# Altium project acopians-powerspy-monitoring-hw.PrjPcb
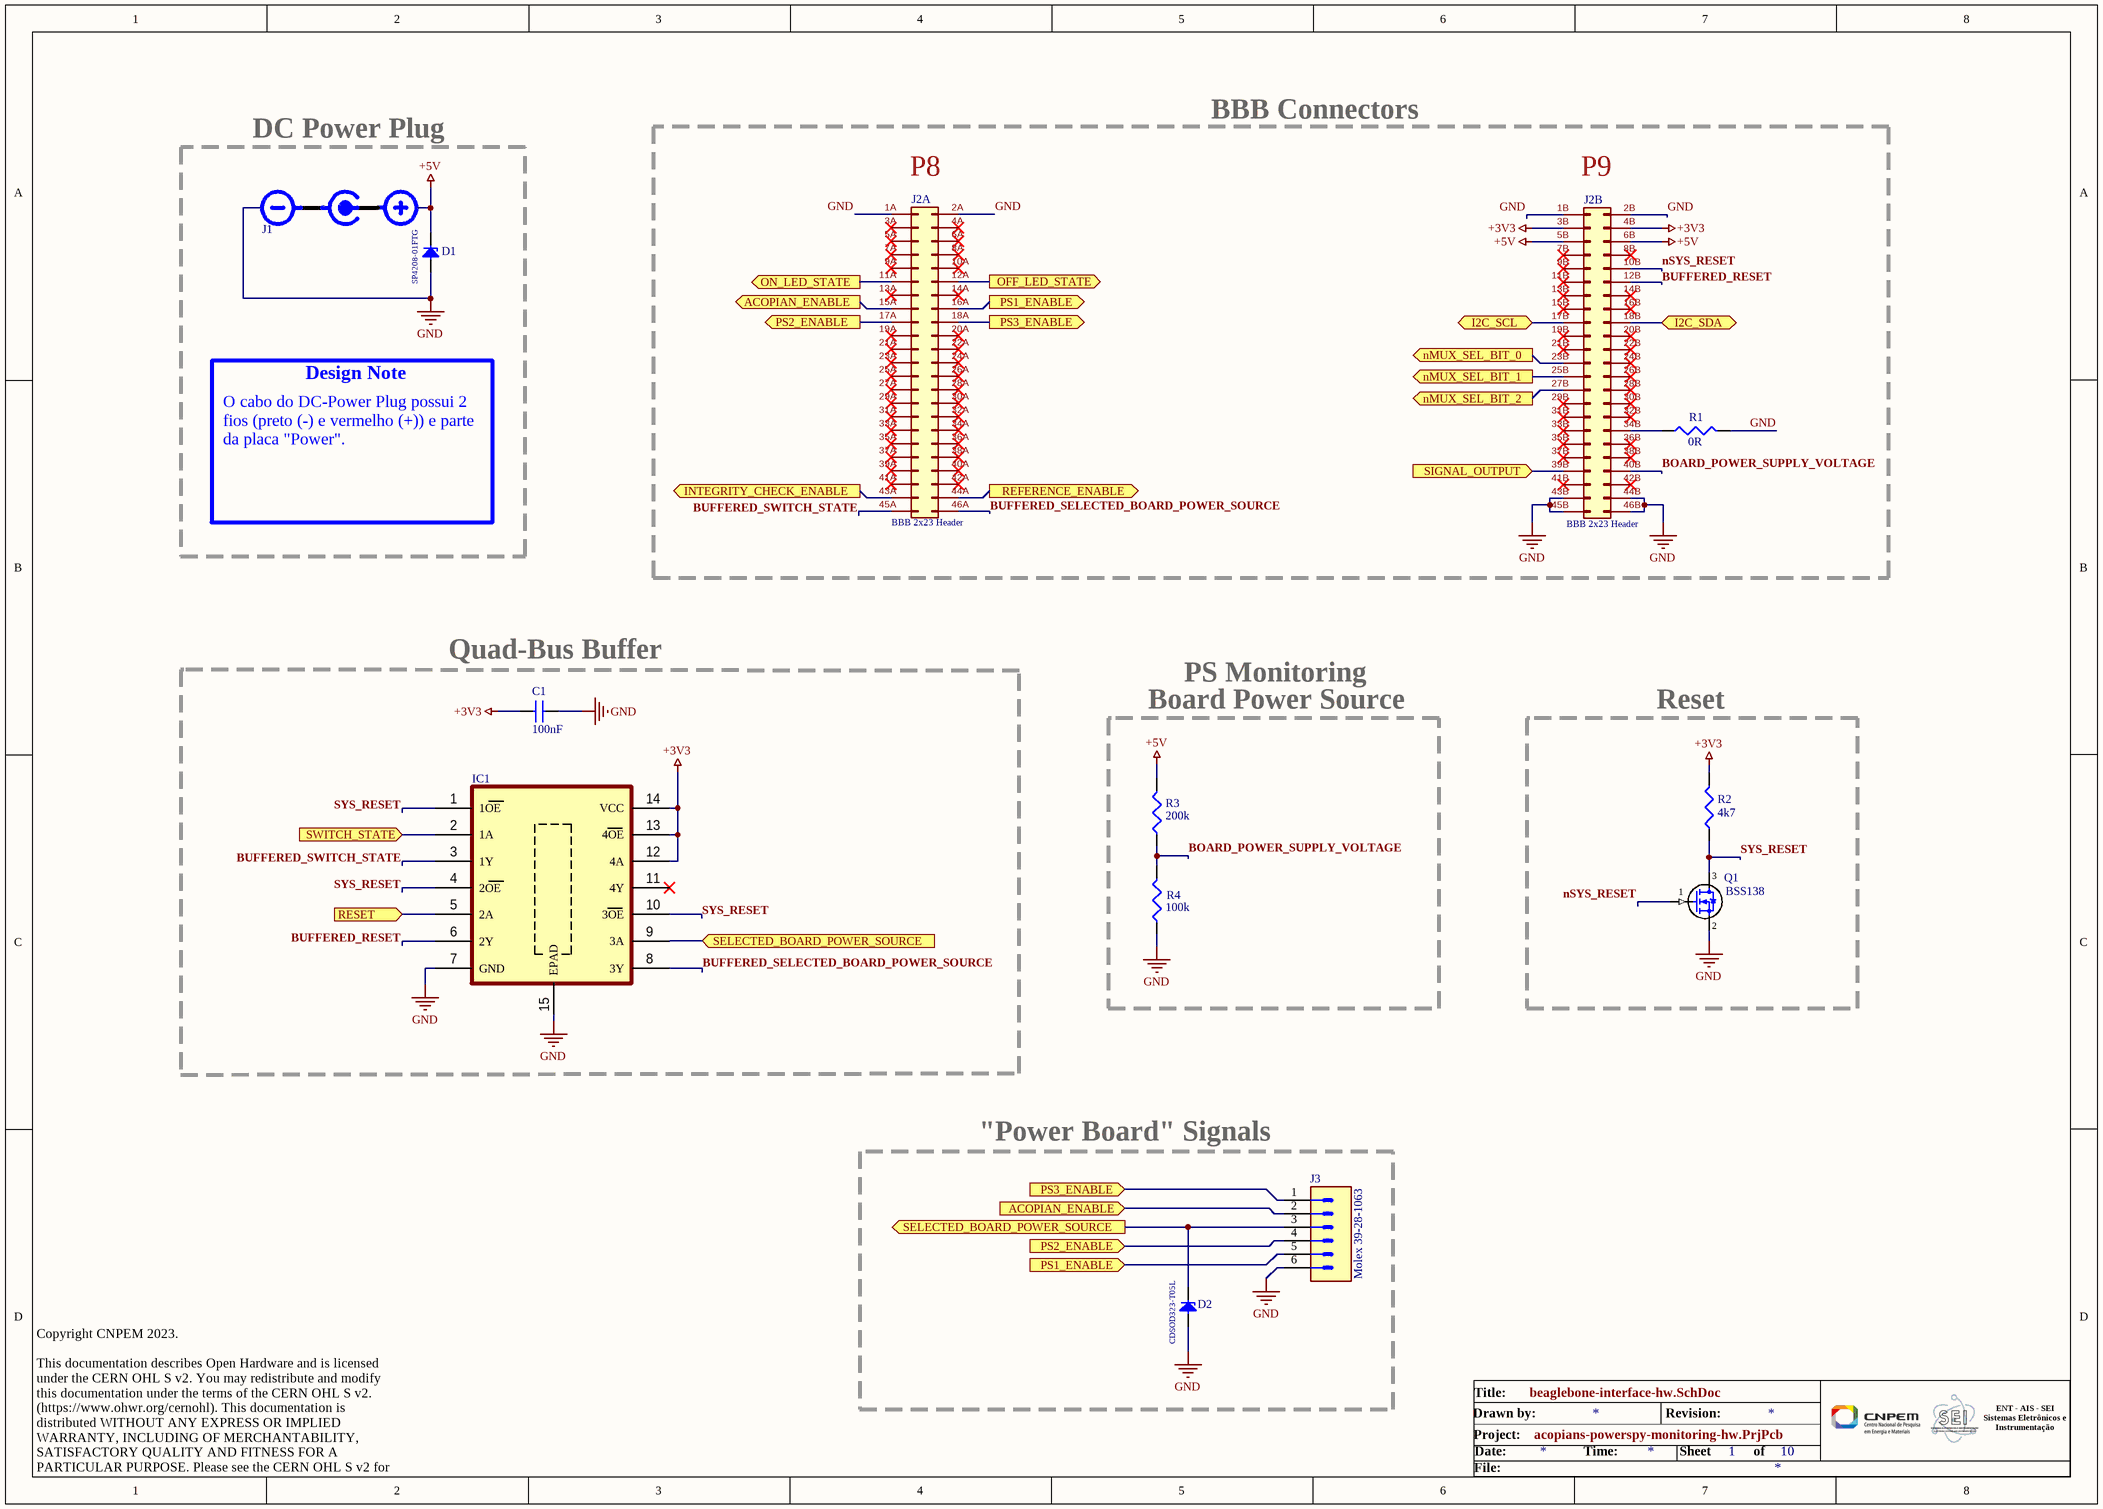
[diagram p0: beaglebone-interface-hw.SchDoc]
Project Link: =ProjectLink
10 sheets, 249 parts. Net scope: flat (ports and power ports of the same name join across sheets).
Board file: pcb-acopians-powerspy-monitoring-hw.PcbDoc
Sheets:
  beaglebone-interface-hw.SchDoc
  calibration-hw.SchDoc
  frontpanel-hw.SchDoc
  isolated-analog-interface-hw.SchDoc
  measurement-output-hw.SchDoc
  measurement-ps1-hw.SchDoc
  measurement-ps2-hw.SchDoc
  measurement-ps3-hw.SchDoc
  power-supplies-hw.SchDoc
  temp-sensor-interface-hw.SchDoc

## Sheet beaglebone-interface-hw.SchDoc
size A3; SheetNumber: 1; SheetTotal: 10

### Parts
C1  100nF  [C0805]
D1  SP4208-01FTG  [SOD-323]
D2  CDSOD323-T05L  [SOD-323]
IC1  SN74LV125ARGYR  [VQFN-14]  (value not drawn)
J1  DC Power Plug  (value not drawn)  (graphical)
J2  BBB 2x23 Header  [BBB 2x23 Header]  (parts A,B of 2)
J3  Molex 39-28-1063  [MOLEX_39-28-1063]
Q1  BSS138  [SOT_23_3]
R1  0R  [R1210]
R2  4k7  [Resistor 0805]
R3  200k  [Resistor 0805]
R4  100k  [Resistor 0805]

### Blocks framed on the sheet
DC Power Plug: D1 J1
Quad-Bus Buffer: C1 IC1
Board Power Source: R3 R4
Reset: Q1 R2
"Power Board" Signals: D2 J3

### Ports
ACOPIAN_ENABLE (in, see beaglebone-interface-hw[3A]), ACOPIAN_ENABLE (out, see beaglebone-interface-hw[4D]), I2C_SCL (bidir, see temp-sensor-interface-hw[5B]), I2C_SDA (bidir, see temp-sensor-interface-hw[5B]), INTEGRITY_CHECK_ENABLE (out, see calibration-hw[6B]), nMUX_SEL_BIT_0 (out, see isolated-analog-interface-hw[5B]), nMUX_SEL_BIT_1 (out, see isolated-analog-interface-hw[5C]), nMUX_SEL_BIT_2 (out, see isolated-analog-interface-hw[5C]), OFF_LED_STATE (out, see frontpanel-hw[5D]), ON_LED_STATE (out, see frontpanel-hw[5C]), PS1_ENABLE (in, see beaglebone-interface-hw[4A]), PS1_ENABLE (out, see beaglebone-interface-hw[4D]), PS2_ENABLE (in, see beaglebone-interface-hw[3A]), PS2_ENABLE (out, see beaglebone-interface-hw[4D]), PS3_ENABLE (in, see beaglebone-interface-hw[4A]), PS3_ENABLE (out, see beaglebone-interface-hw[4D]), REFERENCE_ENABLE (out, see calibration-hw[6C]), RESET (in, see frontpanel-hw[5B]), SELECTED_BOARD_POWER_SOURCE (in, see beaglebone-interface-hw[4D]), SELECTED_BOARD_POWER_SOURCE (out, see beaglebone-interface-hw[3C]), SIGNAL_OUTPUT (in, see isolated-analog-interface-hw[10C]), SWITCH_STATE (in, see frontpanel-hw[5A])

### Nets
+3V3: C1.2 IC1.12(4A) IC1.13(4OE) IC1.14(VCC) J2.3B(Pin_3) J2.4B(Pin_4) R2.2
+5V: D1.1 J1.2(+VCC) J2.5B(Pin_5) J2.6B(Pin_6) R3.2
GND: C1.1 D1.2 D2.2 IC1.7(GND) IC1.15(EPAD) J1.1(GND) J2.1A(Pin_1) J2.1B(Pin_1) J2.2A(Pin_2) J2.2B(Pin_2) J2.43B(Pin_43) J2.44B(Pin_44) J2.45B(Pin_45) J2.46B(Pin_46) J3.6 Q1.2(S) R1.2 R4.1
BOARD_POWER_SUPPLY_VOLTAGE: J2.40B(Pin_40) R3.1 R4.2
BUFFERED_RESET: IC1.6(2Y) J2.12B(Pin_12)
BUFFERED_SELECTED_BOARD_POWER_SOURCE: IC1.8(3Y) J2.46A(Pin_46)
BUFFERED_SWITCH_STATE: IC1.3(1Y) J2.45A(Pin_45)
nSYS_RESET: J2.10B(Pin_10) Q1.1(G)
SYS_RESET: IC1.1(1OE) IC1.4(2OE) IC1.10(3OE) Q1.3(D) R2.1
NetD2_1: D2.1 IC1.9(3A) J3.3 ; port SELECTED_BOARD_POWER_SOURCE
NetD4_1: J2.17B(Pin_17) ; port I2C_SCL
NetD5_1: J2.18B(Pin_18) ; port I2C_SDA
NetD8_1: IC1.2(1A) ; port SWITCH_STATE
NetD10_1: IC1.5(2A) ; port RESET
NetD43_2: J2.39B(Pin_39) ; port SIGNAL_OUTPUT
NetJ2_11A: J2.11A(Pin_11) ; port ON_LED_STATE
NetJ2_12A: J2.12A(Pin_12) ; port OFF_LED_STATE
NetJ2_15A: J2.15A(Pin_15) J3.2 ; port ACOPIAN_ENABLE
NetJ2_16A: J2.16A(Pin_16) J3.5 ; port PS1_ENABLE
NetJ2_17A: J2.17A(Pin_17) J3.4 ; port PS2_ENABLE
NetJ2_18A: J2.18A(Pin_18) J3.1 ; port PS3_ENABLE
NetJ2_23B: J2.23B(Pin_23) ; port nMUX_SEL_BIT_0
NetJ2_25B: J2.25B(Pin_25) ; port nMUX_SEL_BIT_1
NetJ2_27B: J2.27B(Pin_27) ; port nMUX_SEL_BIT_2
NetJ2_34B: J2.34B(Pin_34) R1.1
NetJ2_43A: J2.43A(Pin_43) ; port INTEGRITY_CHECK_ENABLE
NetJ2_44A: J2.44A(Pin_44) ; port REFERENCE_ENABLE

Not connected (* = marked no-connect by the designer): IC1 11(4Y)*; J2 3A(Pin_3)* 4A(Pin_4)* 5A(Pin_5)* 6A(Pin_6)* 7A(Pin_7)* 7B(Pin_7)* 8A(Pin_8)* 8B(Pin_8)* 9A(Pin_9)* 9B(Pin_9)* 10A(Pin_10)* 11B(Pin_11)* 13A(Pin_13)* 13B(Pin_13)* 14A(Pin_14)* 14B(Pin_14)* 15B(Pin_15)* 16B(Pin_16)* 19A(Pin_19)* 19B(Pin_19)* 20A(Pin_20)* 20B(Pin_20)* 21A(Pin_21)* 21B(Pin_21)* 22A(Pin_22)* 22B(Pin_22)* 23A(Pin_23)* 24A(Pin_24)* 24B(Pin_24)* 25A(Pin_25)* 26A(Pin_26)* 26B(Pin_26)* 27A(Pin_27)* 28A(Pin_28)* 28B(Pin_28)* 29A(Pin_29)* 29B(Pin_29)* 30A(Pin_30)* 30B(Pin_30)* 31A(Pin_31)* 31B(Pin_31)* 32A(Pin_32)* 32B(Pin_32)* 33A(Pin_33)* 33B(Pin_33)* 34A(Pin_34)* 35A(Pin_35)* 35B(Pin_35)* 36A(Pin_36)* 36B(Pin_36)* 37A(Pin_37)* 37B(Pin_37)* 38A(Pin_38)* 38B(Pin_38)* 39A(Pin_39)* 40A(Pin_40)* 41A(Pin_41)* 41B(Pin_41)* 42A(Pin_42)* 42B(Pin_42)*

### Notes on the sheet
- (near J2) P8
- BBB Connectors
- (near J2) P9
- Design Note
- O cabo do DC-Power Plug possui 2 fios (preto (-) e vermelho (+)) e parte da placa "Power".
- PS Monitoring
- Title:
- Date:
- Project:
- Drawn by:
- Time:
- Revision:
- Sheet
- of
- ENT - AIS - SEI
  Sistemas Eletrônicos e
  Instrumentação
- Copyright CNPEM 2023.
  This documentation describes Open Hardware and is licensed under the CERN OHL S v2. You may redistribute and modify this documentation under the terms of the CERN OHL S v2. (https://www.ohwr.org/cernohl). This documentation is distributed WITHOUT ANY EXPRESS OR IMPLIED WARRANTY, INCLUDING OF MERCHANTABILITY, SATISFACTORY QUALITY AND FITNESS FOR A PARTICULAR PURPOSE. Please see the CERN OHL S v2 for applicable conditions.
- File:

### Library data of the parts
C1 = Capacitor 100nF
D1 = SP4208-01FTG: Unidirectional TVS Diode; Supplier 1: Newark; Supplier Part Number 1: 54AH3799
D2 = CDSOD323-T05L: Unidirectional TVS Diode; Supplier 1: Avnet; Supplier Part Number 1: CDSOD323-T05L
IC1 = SN74LV125ARGYR: Quadruple Bus Buffer Gates With 3-State Outputs
J3 = Connector 6 Male
Q1 = BSS138: MOSFET N-Channel; Supplier 1: Digi-Key; Supplier Part Number 1: BSS138DKR-ND
R1 = Resistor 0R: Size 1210
R2 = Resistor 4k7: Size 0805
R3 = Resistor 200k: Size 0805
R4 = Resistor 100k

## Sheet calibration-hw.SchDoc
size A2; SheetNumber: 2; SheetTotal: 10
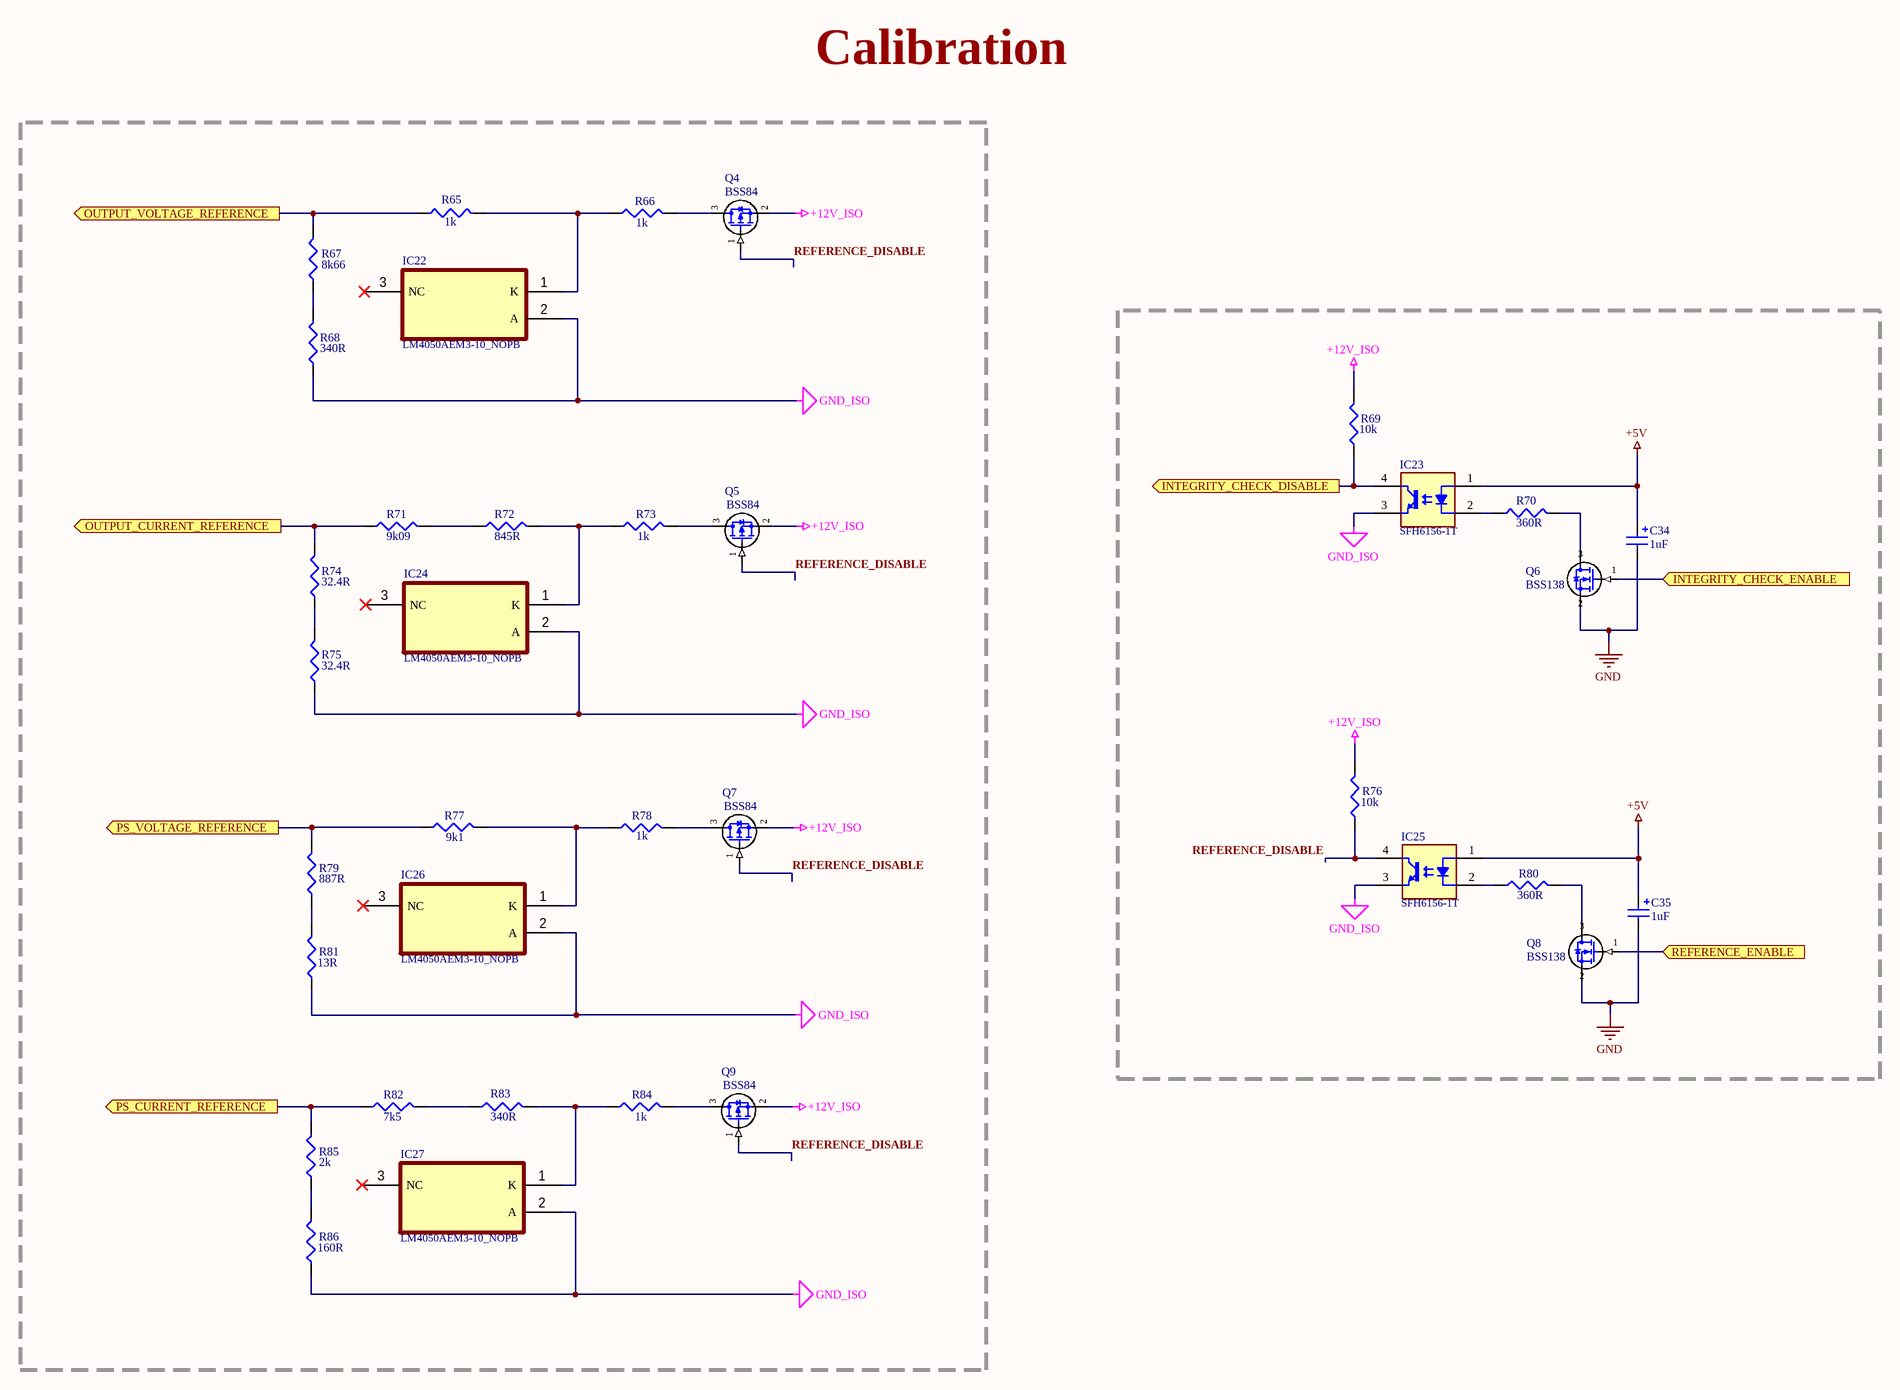
[diagram p1: calibration-hw.SchDoc]

### Parts
C34  1uF  [C1206]
C35  1uF  [C1206]
IC22  LM4050AEM3-10_NOPB  [SOT_23_3]
IC23  SFH6156-1T  [SMD-4]
IC24  LM4050AEM3-10_NOPB  [SOT_23_3]
IC25  SFH6156-1T  [SMD-4]
IC26  LM4050AEM3-10_NOPB  [SOT_23_3]
IC27  LM4050AEM3-10_NOPB  [SOT_23_3]
Q4  BSS84  [SOT_23_3]
Q5  BSS84  [SOT_23_3]
Q6  BSS138  [SOT_23_3]
Q7  BSS84  [SOT_23_3]
Q8  BSS138  [SOT_23_3]
Q9  BSS84  [SOT_23_3]
R65  1k  [Resistor 0805]
R66  1k  [Resistor 0805]
R67  8k66  [Resistor 0805]
R68  340R  [Resistor 0805]
R69  10k  [Resistor 0805]
R70  360R  [Resistor 0805]
R71  9k09  [Resistor 0805]
R72  845R  [Resistor 0805]
R73  1k  [Resistor 0805]
R74  32.4R  [Resistor 0805]
R75  32.4R  [Resistor 0805]
R76  10k  [Resistor 0805]
R77  9k1  [Resistor 0805]
R78  1k  [Resistor 0805]
R79  887R  [Resistor 0805]
R80  360R  [Resistor 0805]
R81  13R  [Resistor 0805]
R82  7k5  [Resistor 0805]
R83  340R  [Resistor 0805]
R84  1k  [Resistor 0805]
R85  2k  [Resistor 0805]
R86  160R  [Resistor 0805]

### Ports
INTEGRITY_CHECK_DISABLE (out, see measurement-output-hw[2B], measurement-output-hw[2D], measurement-output-hw[4B], measurement-output-hw[4D], measurement-ps1-hw[1C], measurement-ps1-hw[3C], measurement-ps2-hw[1B], measurement-ps2-hw[3B], measurement-ps3-hw[1B], measurement-ps3-hw[3B]), INTEGRITY_CHECK_ENABLE (in, see beaglebone-interface-hw[3B]), OUTPUT_CURRENT_REFERENCE (out, see measurement-output-hw[2D]), OUTPUT_VOLTAGE_REFERENCE (out, see measurement-output-hw[2B]), PS_CURRENT_REFERENCE (out, see measurement-ps1-hw[3C], measurement-ps2-hw[3C], measurement-ps3-hw[3C]), PS_VOLTAGE_REFERENCE (out, see measurement-ps1-hw[1C], measurement-ps2-hw[1C], measurement-ps3-hw[1C]), REFERENCE_ENABLE (in, see beaglebone-interface-hw[4B])

### Nets
+5V: C34.1 C35.1 IC23.1(A) IC25.1(A)
+12V_ISO: Q4.2(S) Q5.2(S) Q7.2(S) Q9.2(S) R69.2 R76.2
GND: C34.2 C35.2 Q6.2(S) Q8.2(S)
GND_ISO: IC22.2(A) IC23.3(E) IC24.2(A) IC25.3(E) IC26.2(A) IC27.2(A) R68.1 R75.1 R81.1 R86.1
REFERENCE_DISABLE: IC25.4(C) Q4.1(G) Q5.1(G) Q7.1(G) Q9.1(G) R76.1
NetIC6_1: IC23.4(C) R69.1 ; port INTEGRITY_CHECK_DISABLE
NetIC6_4: R77.1 R79.2 ; port PS_VOLTAGE_REFERENCE
NetIC6_11: R82.1 R85.2 ; port PS_CURRENT_REFERENCE
NetIC17_4: R65.1 R67.2 ; port OUTPUT_VOLTAGE_REFERENCE
NetIC20_4: R71.1 R74.2 ; port OUTPUT_CURRENT_REFERENCE
NetIC22_1: IC22.1(K) R65.2 R66.1
NetIC23_2: IC23.2(C) R70.1
NetIC24_1: IC24.1(K) R72.2 R73.1
NetIC25_2: IC25.2(C) R80.1
NetIC26_1: IC26.1(K) R77.2 R78.1
NetIC27_1: IC27.1(K) R83.2 R84.1
NetJ2_43A: Q6.1(G) ; port INTEGRITY_CHECK_ENABLE
NetJ2_44A: Q8.1(G) ; port REFERENCE_ENABLE
NetQ4_3: Q4.3(D) R66.2
NetQ5_3: Q5.3(D) R73.2
NetQ6_3: Q6.3(D) R70.2
NetQ7_3: Q7.3(D) R78.2
NetQ8_3: Q8.3(D) R80.2
NetQ9_3: Q9.3(D) R84.2
NetR67_1: R67.1 R68.2
NetR71_2: R71.2 R72.1
NetR74_1: R74.1 R75.2
NetR79_1: R79.1 R81.2
NetR82_2: R82.2 R83.1
NetR85_1: R85.1 R86.2

Not connected (* = marked no-connect by the designer): IC22 3(NC)*; IC24 3(NC)*; IC26 3(NC)*; IC27 3(NC)*

### Notes on the sheet
- Calibration
- Title:
- Drawn by:
- Revision:
- Copyright CNPEM 2023.
  This documentation describes Open Hardware and is licensed under the CERN OHL S v2. You may redistribute and modify this documentation under the terms of the CERN OHL S v2. (https://www.ohwr.org/cernohl). This documentation is distributed WITHOUT ANY EXPRESS OR IMPLIED WARRANTY, INCLUDING OF MERCHANTABILITY, SATISFACTORY QUALITY AND FITNESS FOR A PARTICULAR PURPOSE. Please see the CERN OHL S v2 for applicable conditions.
- File:
- Date:
- Project:
- Time:
- Sheet
- of
- ENT - AIS - SEI
  Sistemas Eletrônicos e
  Instrumentação

### Library data of the parts
C34 C35 = Capacitor 1uF
IC22 IC24 IC26 IC27 = LM4050AEM3-10_NOPB: Precision Micropower Shunt Voltage Reference
IC23 IC25 = SFH6156-1T: Optocoupler 1 Channel, Phototransistor Output, SMD-4
Q4 Q5 Q7 Q9 = BSS84: MOSFET P-Channel
Q6 Q8 = BSS138: MOSFET N-Channel; Supplier 1: Digi-Key; Supplier Part Number 1: BSS138DKR-ND
R65 R66 R73 R78 R84 = Resistor 1k
R67 = Resistor 8k66
R68 R83 = Resistor 340R
R69 R76 = Resistor 10k
R70 R80 = Resistor 360R
R71 = Resistor 9k09
R72 = Resistor 845R
R74 R75 = Resistor 32.4R
R77 = Resistor 9k1
R79 = Resistor 887R
R81 = Resistor 13R
R82 = Resistor 7k5
R85 = Resistor 2k
R86 = Resistor 160R

## Sheet frontpanel-hw.SchDoc
size A3; SheetNumber: 3; SheetTotal: 10
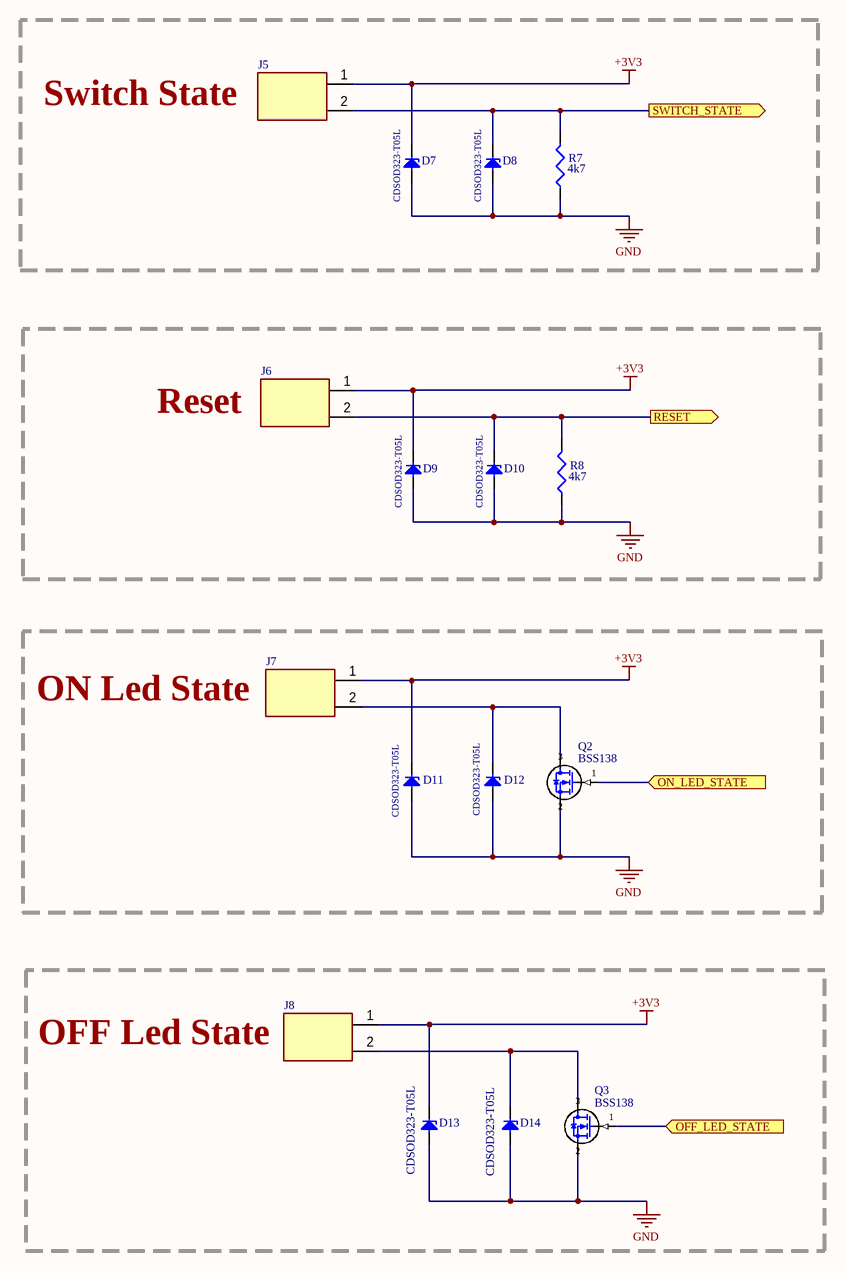
[diagram p2: frontpanel-hw.SchDoc]

### Parts
D7  CDSOD323-T05L  [SOD-323]
D8  CDSOD323-T05L  [SOD-323]
D9  CDSOD323-T05L  [SOD-323]
D10  CDSOD323-T05L  [SOD-323]
D11  CDSOD323-T05L  [SOD-323]
D12  CDSOD323-T05L  [SOD-323]
D13  CDSOD323-T05L  [SOD-323]
D14  CDSOD323-T05L  [SOD-323]
J5  +15VDC Connector  [+15VDC Connector]  (value not drawn)
J6  +15VDC Connector  [+15VDC Connector]  (value not drawn)
J7  +15VDC Connector  [+15VDC Connector]  (value not drawn)
J8  +15VDC Connector  [+15VDC Connector]  (value not drawn)
Q2  BSS138  [SOT_23_3]
Q3  BSS138  [SOT_23_3]
R7  4k7  [Resistor 0805]
R8  4k7  [Resistor 0805]

### Blocks framed on the sheet
Switch State: D7 D8 J5 R7
Reset: D9 D10 J6 R8
ON Led State: D11 D12 J7 Q2
OFF Led State: D13 D14 J8 Q3

### Ports
OFF_LED_STATE (in, see beaglebone-interface-hw[4A]), ON_LED_STATE (in, see beaglebone-interface-hw[3A]), RESET (out, see beaglebone-interface-hw[2C]), SWITCH_STATE (out, see beaglebone-interface-hw[2C])

### Nets
+3V3: D7.1 D9.1 D11.1 D13.1 J5.1 J6.1 J7.1 J8.1
GND: D7.2 D8.2 D9.2 D10.2 D11.2 D12.2 D13.2 D14.2 Q2.2(S) Q3.2(S) R7.1 R8.1
NetD8_1: D8.1 J5.2 R7.2 ; port SWITCH_STATE
NetD10_1: D10.1 J6.2 R8.2 ; port RESET
NetD12_1: D12.1 J7.2 Q2.3(D)
NetD14_1: D14.1 J8.2 Q3.3(D)
NetJ2_11A: Q2.1(G) ; port ON_LED_STATE
NetJ2_12A: Q3.1(G) ; port OFF_LED_STATE

### Notes on the sheet
- Title:
- Date:
- Project:
- Drawn by:
- Time:
- Revision:
- Sheet
- of
- ENT - AIS - SEI
  Sistemas Eletrônicos e
  Instrumentação
- Copyright CNPEM 2023.
  This documentation describes Open Hardware and is licensed under the CERN OHL S v2. You may redistribute and modify this documentation under the terms of the CERN OHL S v2. (https://www.ohwr.org/cernohl). This documentation is distributed WITHOUT ANY EXPRESS OR IMPLIED WARRANTY, INCLUDING OF MERCHANTABILITY, SATISFACTORY QUALITY AND FITNESS FOR A PARTICULAR PURPOSE. Please see the CERN OHL S v2 for applicable conditions.
- File:

### Library data of the parts
D7-D14 = CDSOD323-T05L: Unidirectional TVS Diode; Supplier 1: Avnet; Supplier Part Number 1: CDSOD323-T05L
Q2 Q3 = BSS138: MOSFET N-Channel; Supplier 1: Digi-Key; Supplier Part Number 1: BSS138DKR-ND
R7 R8 = Resistor 4k7: Size 0805

## Sheet isolated-analog-interface-hw.SchDoc
size A1; SheetNumber: 4; SheetTotal: 10
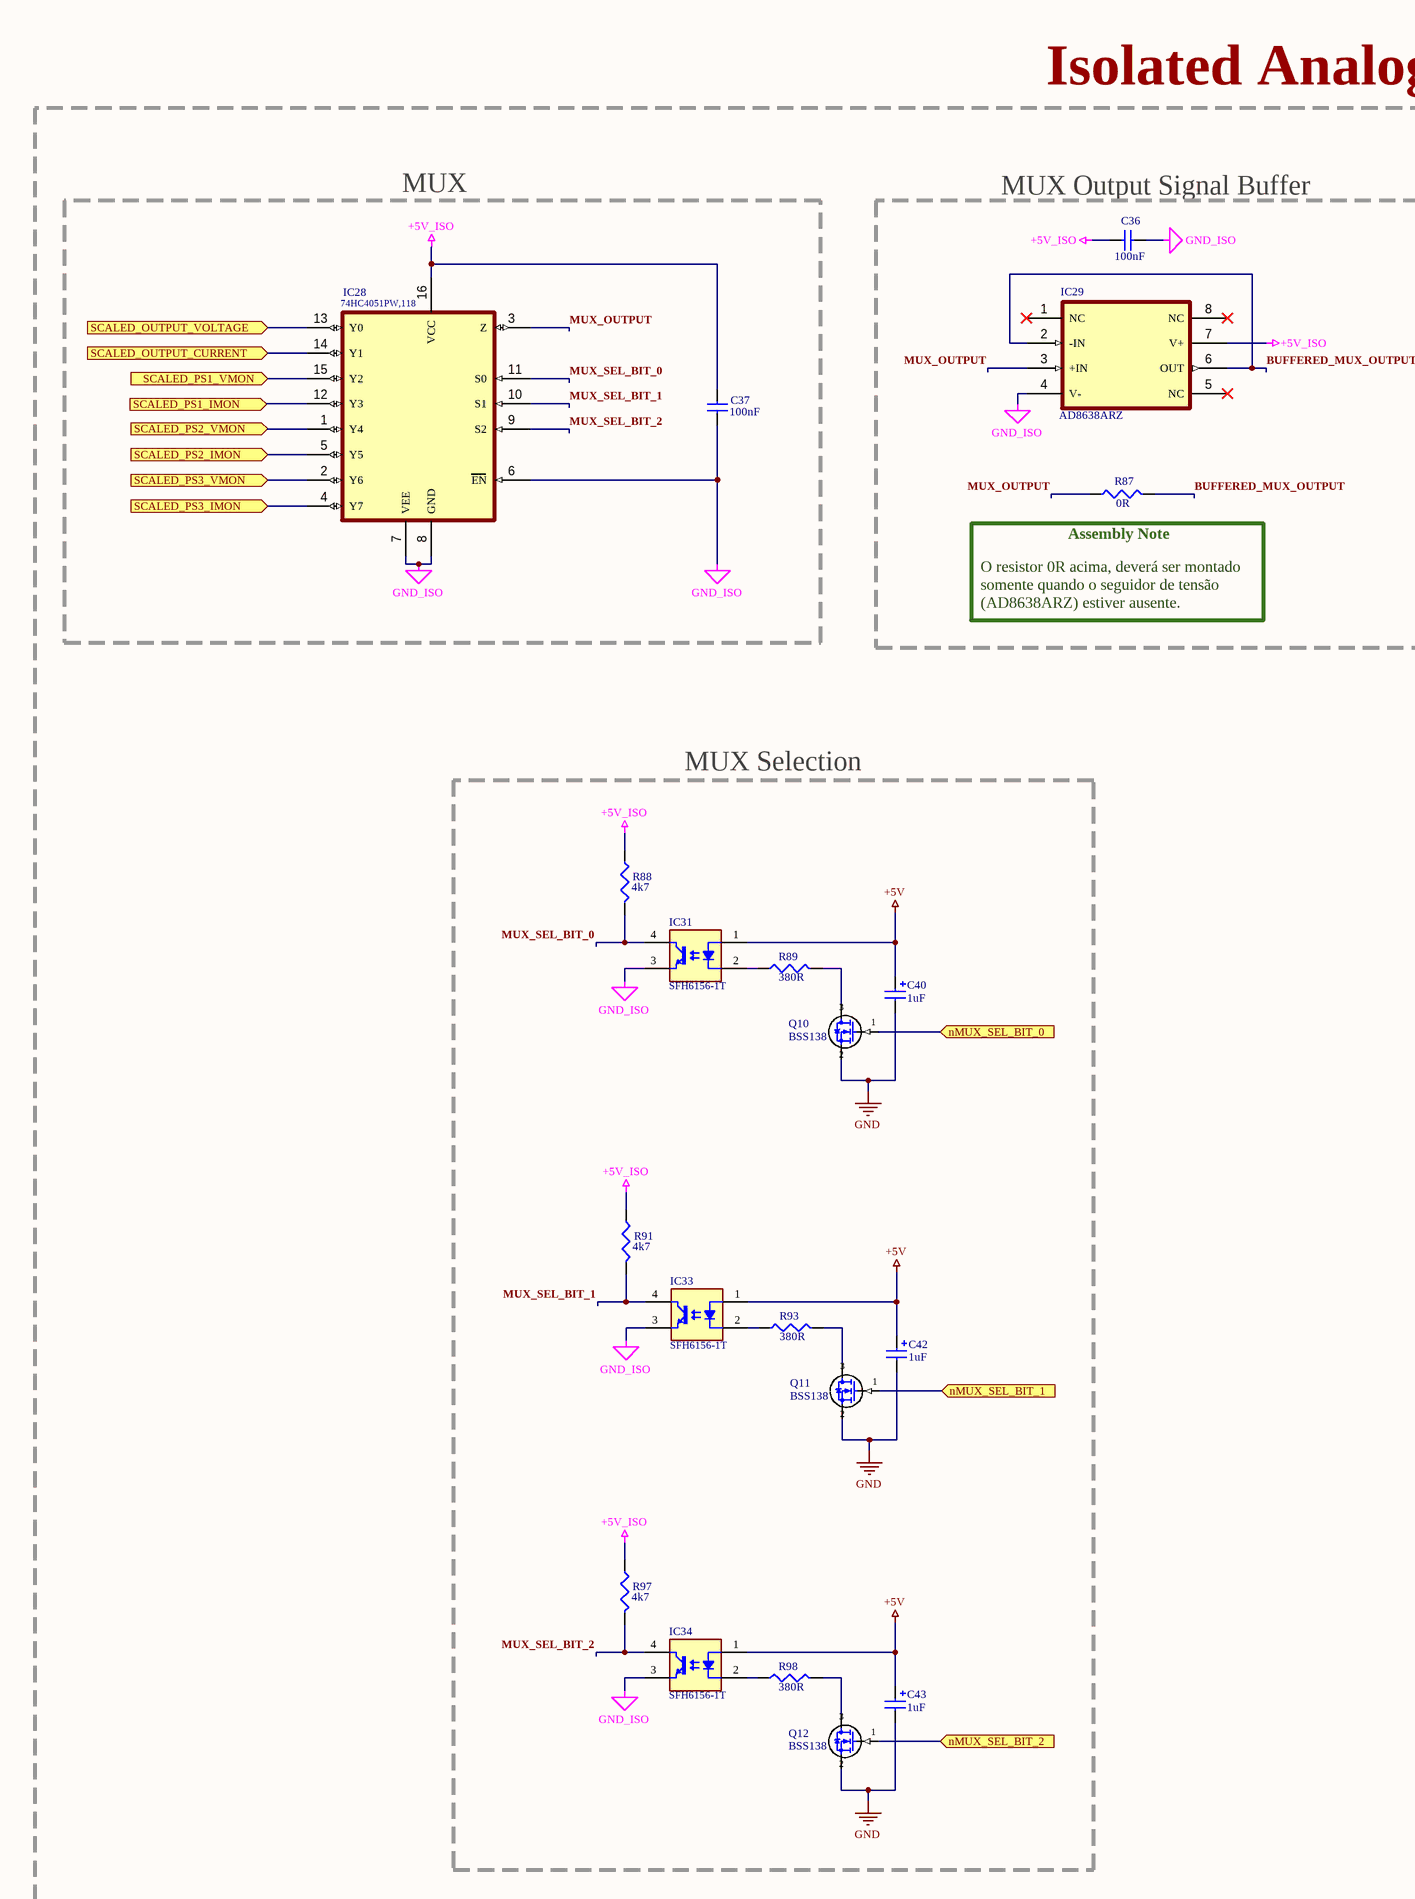
[diagram p3: isolated-analog-interface-hw.SchDoc, left]
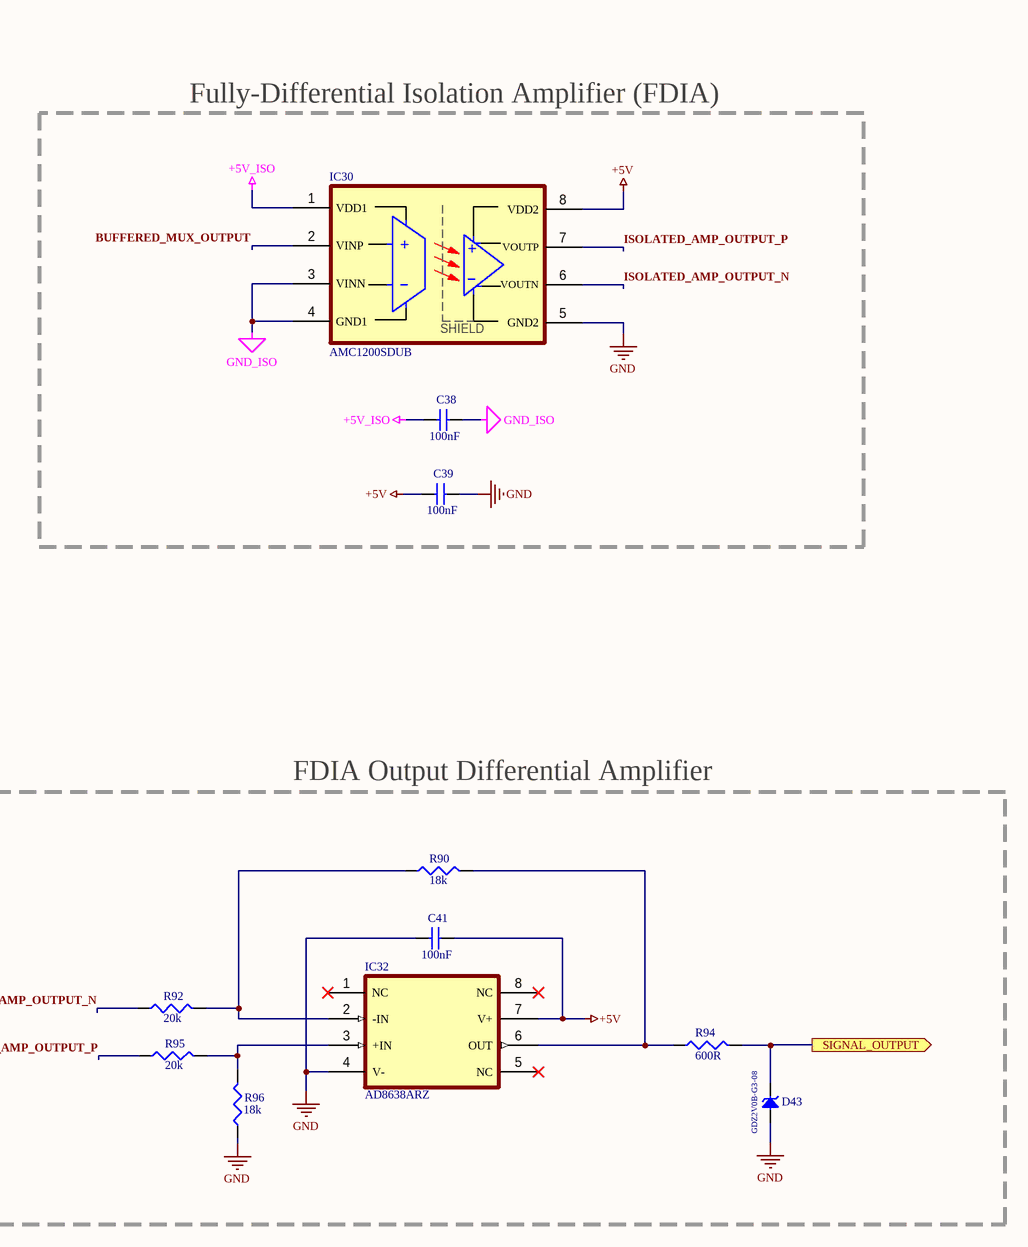
[diagram p4: isolated-analog-interface-hw.SchDoc, right]

### Parts
C36  100nF  [C0805]
C37  100nF  [C0805]
C38  100nF  [C0805]
C39  100nF  [C0805]
C40  1uF  [C1206]
C41  100nF  [C0805]
C42  1uF  [C1206]
C43  1uF  [C1206]
D43  GDZ2V0B-G3-08  [SOD-323]
IC28  74HC4051PW,118  [TSSOP-16]
IC29  AD8638ARZ  [SOIC-8]
IC30  AMC1200SDUB  [SOP-8]
IC31  SFH6156-1T  [SMD-4]
IC32  AD8638ARZ  [SOIC-8]
IC33  SFH6156-1T  [SMD-4]
IC34  SFH6156-1T  [SMD-4]
Q10  BSS138  [SOT_23_3]
Q11  BSS138  [SOT_23_3]
Q12  BSS138  [SOT_23_3]
R87  0R  [Resistor 0805]
R88  4k7  [Resistor 0805]
R89  380R  [Resistor 0805]
R90  18k  [Resistor 0805]
R91  4k7  [Resistor 0805]
R92  20k  [Resistor 0805]
R93  380R  [Resistor 0805]
R94  600R  [Resistor 0805]
R95  20k  [Resistor 0805]
R96  18k  [Resistor 0805]
R97  4k7  [Resistor 0805]
R98  380R  [Resistor 0805]

### Blocks framed on the sheet
MUX: C37 IC28
MUX Output Signal Buffer: C36 IC29 R87
Fully-Differential Isolation Amplifier (FDIA): C38 C39 IC30
MUX Selection: C40 C42 C43 IC31 IC33 IC34 Q10-Q12 R88 R89 R91 R93 R97 R98
FDIA Output Differential Amplifier: C41 D43 IC32 R90 R92 R94-R96

### Ports
nMUX_SEL_BIT_0 (in, see beaglebone-interface-hw[6A]), nMUX_SEL_BIT_1 (in, see beaglebone-interface-hw[6A]), nMUX_SEL_BIT_2 (in, see beaglebone-interface-hw[6B]), SCALED_OUTPUT_CURRENT (in, see measurement-output-hw[9D]), SCALED_OUTPUT_VOLTAGE (in, see measurement-output-hw[9B]), SCALED_PS1_IMON (in, see measurement-ps1-hw[6C]), SCALED_PS1_VMON (in, see measurement-ps1-hw[6B]), SCALED_PS2_IMON (in, see measurement-ps2-hw[6C]), SCALED_PS2_VMON (in, see measurement-ps2-hw[6B]), SCALED_PS3_IMON (in, see measurement-ps3-hw[6C]), SCALED_PS3_VMON (in, see measurement-ps3-hw[6B]), SIGNAL_OUTPUT (out, see beaglebone-interface-hw[6B])

### Nets
+5V: C39.1 C40.1 C41.2 C42.1 C43.1 IC30.8(VDD2) IC31.1(A) IC32.7(V+) IC33.1(A) IC34.1(A)
+5V_ISO: C36.1 C37.1 C38.1 IC28.16(VCC) IC29.7(V+) IC30.1(VDD1) R88.1 R91.1 R97.1
GND: C39.2 C40.2 C41.1 C42.2 C43.2 D43.1 IC30.5(GND2) IC32.4(V-) Q10.2(S) Q11.2(S) Q12.2(S) R96.1
GND_ISO: C36.2 C37.2 C38.2 IC28.6(EN) IC28.7(VEE) IC28.8(GND) IC29.4(V-) IC30.3(VINN) IC30.4(GND1) IC31.3(E) IC33.3(E) IC34.3(E)
BUFFERED_MUX_OUTPUT: IC29.2(-IN) IC29.6(OUT) IC30.2(VINP) R87.2
ISOLATED_AMP_OUTPUT_N: IC30.6(VOUTN) R92.1
ISOLATED_AMP_OUTPUT_P: IC30.7(VOUTP) R95.1
MUX_OUTPUT: IC28.3(Z) IC29.3(+IN) R87.1
MUX_SEL_BIT_0: IC28.11(S0) IC31.4(C) R88.2
MUX_SEL_BIT_1: IC28.10(S1) IC33.4(C) R91.2
MUX_SEL_BIT_2: IC28.9(S2) IC34.4(C) R97.2
NetD43_2: D43.2 R94.2 ; port SIGNAL_OUTPUT
NetIC28_1: IC28.1(Y4) ; port SCALED_PS2_VMON
NetIC28_2: IC28.2(Y6) ; port SCALED_PS3_VMON
NetIC28_4: IC28.4(Y7) ; port SCALED_PS3_IMON
NetIC28_5: IC28.5(Y5) ; port SCALED_PS2_IMON
NetIC28_12: IC28.12(Y3) ; port SCALED_PS1_IMON
NetIC28_13: IC28.13(Y0) ; port SCALED_OUTPUT_VOLTAGE
NetIC28_14: IC28.14(Y1) ; port SCALED_OUTPUT_CURRENT
NetIC28_15: IC28.15(Y2) ; port SCALED_PS1_VMON
NetIC31_2: IC31.2(C) R89.1
NetIC32_2: IC32.2(-IN) R90.1 R92.2
NetIC32_3: IC32.3(+IN) R95.2 R96.2
NetIC32_6: IC32.6(OUT) R90.2 R94.1
NetIC33_2: IC33.2(C) R93.1
NetIC34_2: IC34.2(C) R98.1
NetJ2_23B: Q10.1(G) ; port nMUX_SEL_BIT_0
NetJ2_25B: Q11.1(G) ; port nMUX_SEL_BIT_1
NetJ2_27B: Q12.1(G) ; port nMUX_SEL_BIT_2
NetQ10_3: Q10.3(D) R89.2
NetQ11_3: Q11.3(D) R93.2
NetQ12_3: Q12.3(D) R98.2

Not connected (* = marked no-connect by the designer): IC29 1(NC)* 5(NC)* 8(NC)*; IC32 1(NC)* 5(NC)* 8(NC)*

### Notes on the sheet
- Isolated Analog Interface
- (near R87) Assembly Note
- O resistor 0R acima, deverá ser montado somente quando o seguidor de tensão (AD8638ARZ) estiver ausente.
- Title:
- Drawn by:
- Revision:
- Copyright CNPEM 2023.
  This documentation describes Open Hardware and is licensed under the CERN OHL S v2. You may redistribute and modify this documentation under the terms of the CERN OHL S v2. (https://www.ohwr.org/cernohl). This documentation is distributed WITHOUT ANY EXPRESS OR IMPLIED WARRANTY, INCLUDING OF MERCHANTABILITY, SATISFACTORY QUALITY AND FITNESS FOR A PARTICULAR PURPOSE. Please see the CERN OHL S v2 for applicable conditions.
- File:
- Date:
- Project:
- Time:
- Sheet
- of
- ENT - AIS - SEI
  Sistemas Eletrônicos e
  Instrumentação
- (in symbol AMC1200SDUB) +; SHIELD

### Library data of the parts
C36-C39 C41 = Capacitor 100nF
C40 C42 C43 = Capacitor 1uF
D43 = Zener GDZ2V0B-G3-08: Supplier 1: Arrow Electronics; Supplier Part Number 1: GDZ2V0B-G3-08
IC28 = 74HC4051PW,118: 8-channel analog multiplexer, TSSOP-16
IC29 IC32 = AD8638ARZ: 16V, Auto-Zero, Rail-to-Rail Output Operational Amplifiers
IC30 = AMC1200SDUB: Fully-Differential Isolation Amplifier
IC31 IC33 IC34 = SFH6156-1T: as IC23 on sheet calibration-hw
Q10-Q12 = BSS138: MOSFET N-Channel; Supplier 1: Digi-Key; Supplier Part Number 1: BSS138DKR-ND
R87 = Resistor 0R - 0805: Size 0805
R88 R91 R97 = Resistor 4k7: Size 0805
R89 R93 R98 = Resistor 380R: Size 0805
R90 R96 = Resistor 18k
R92 R95 = Resistor 20k
R94 = Resistor 600R

## Sheet measurement-output-hw.SchDoc
size A1; SheetNumber: 5; SheetTotal: 10
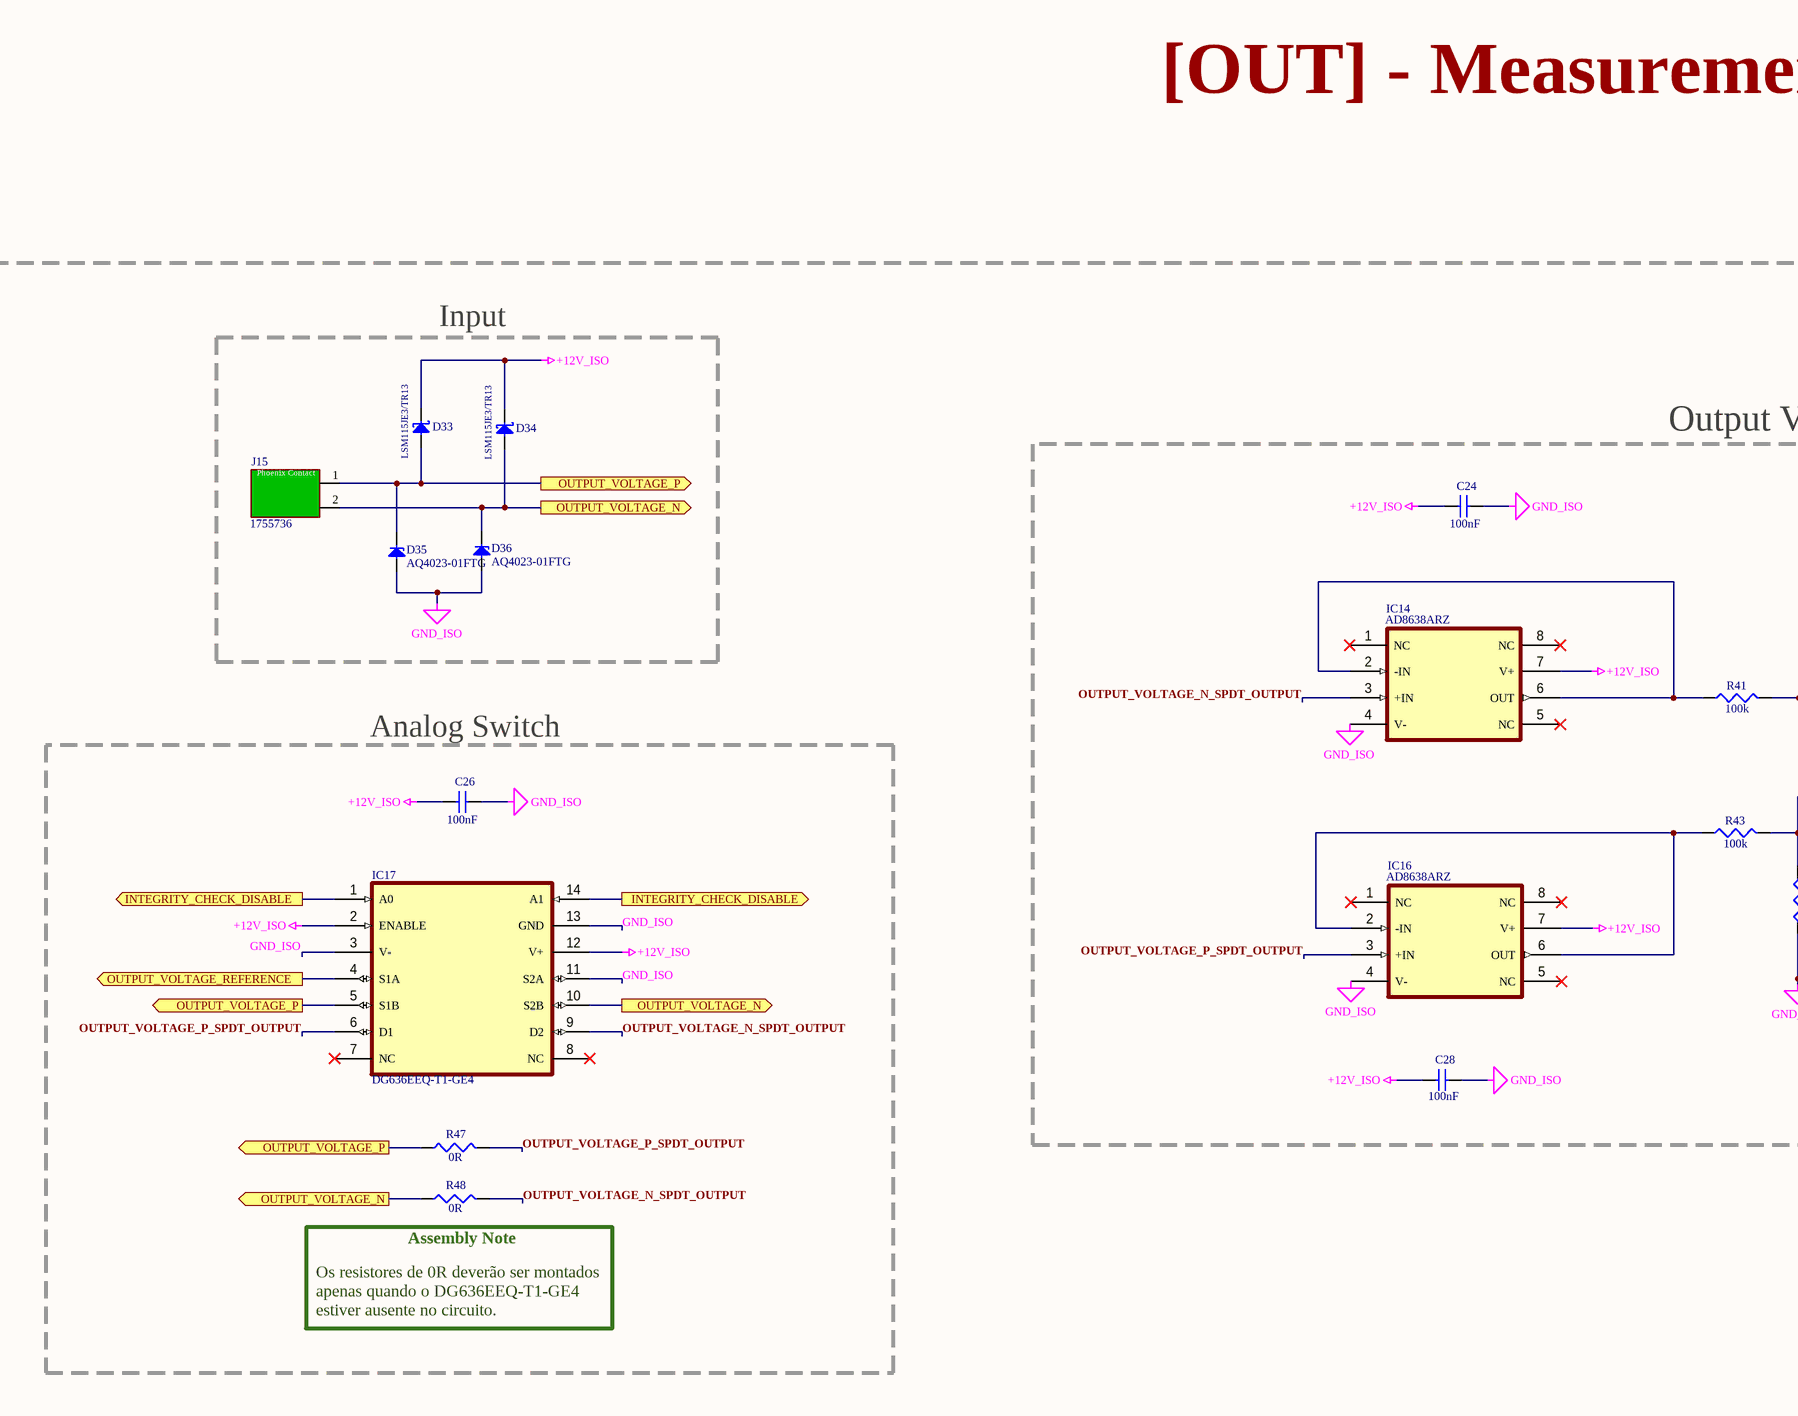
[diagram p5: measurement-output-hw.SchDoc, top left]
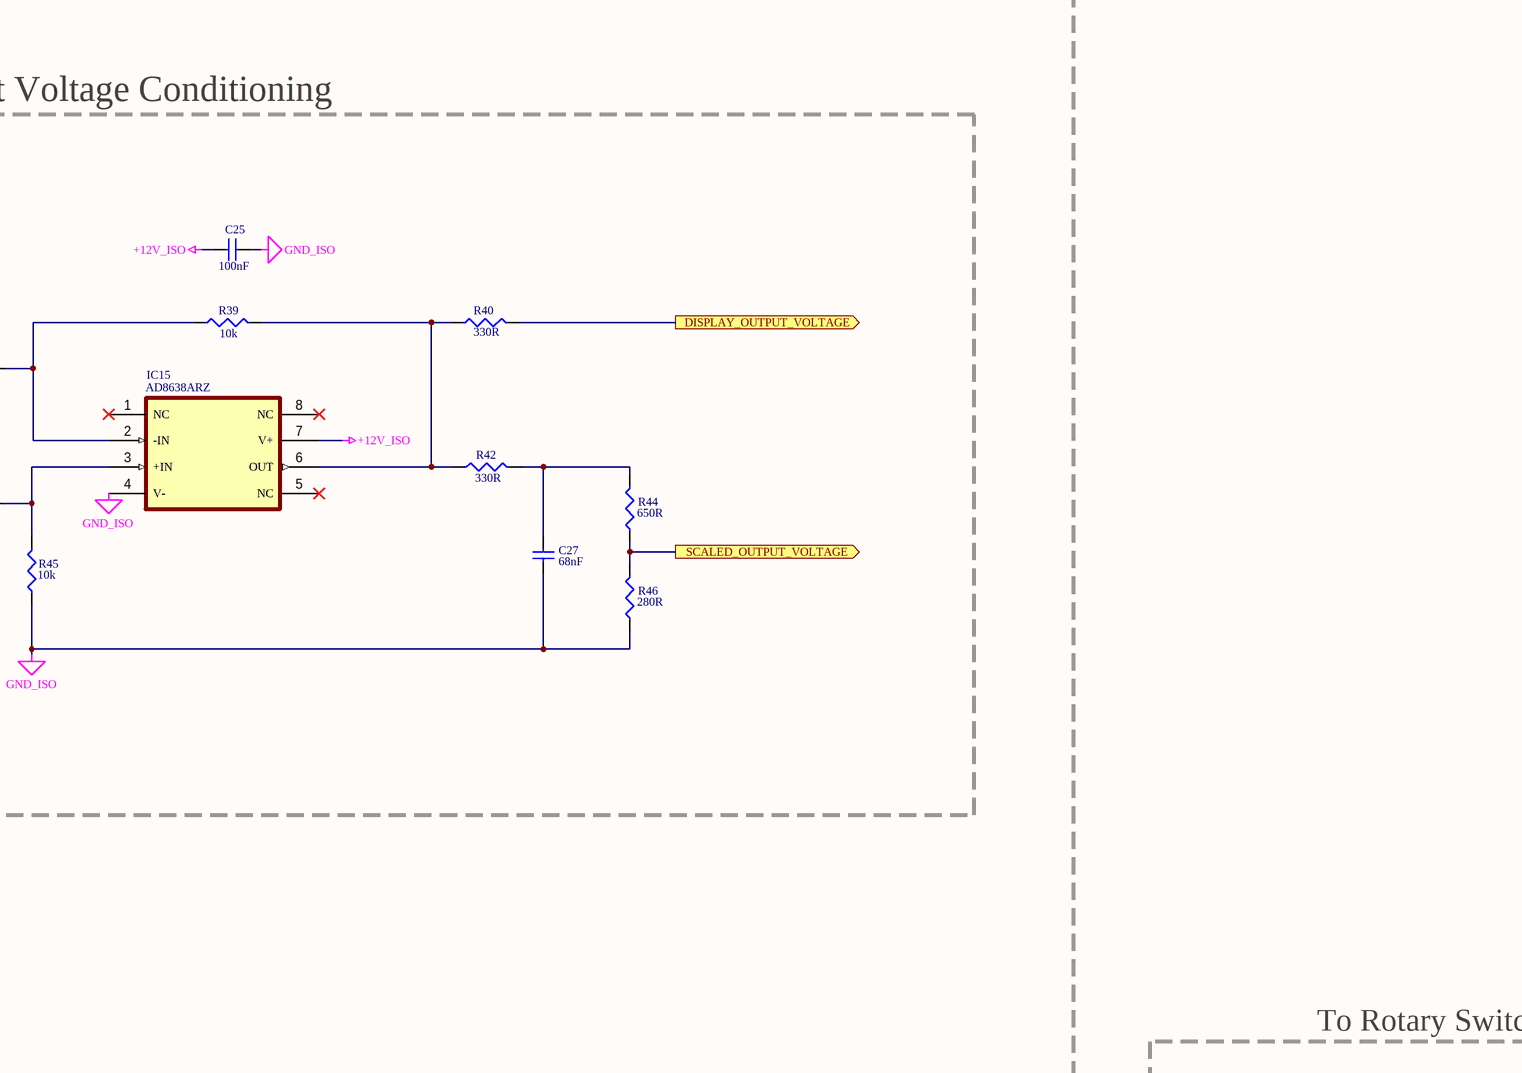
[diagram p6: measurement-output-hw.SchDoc, top right]
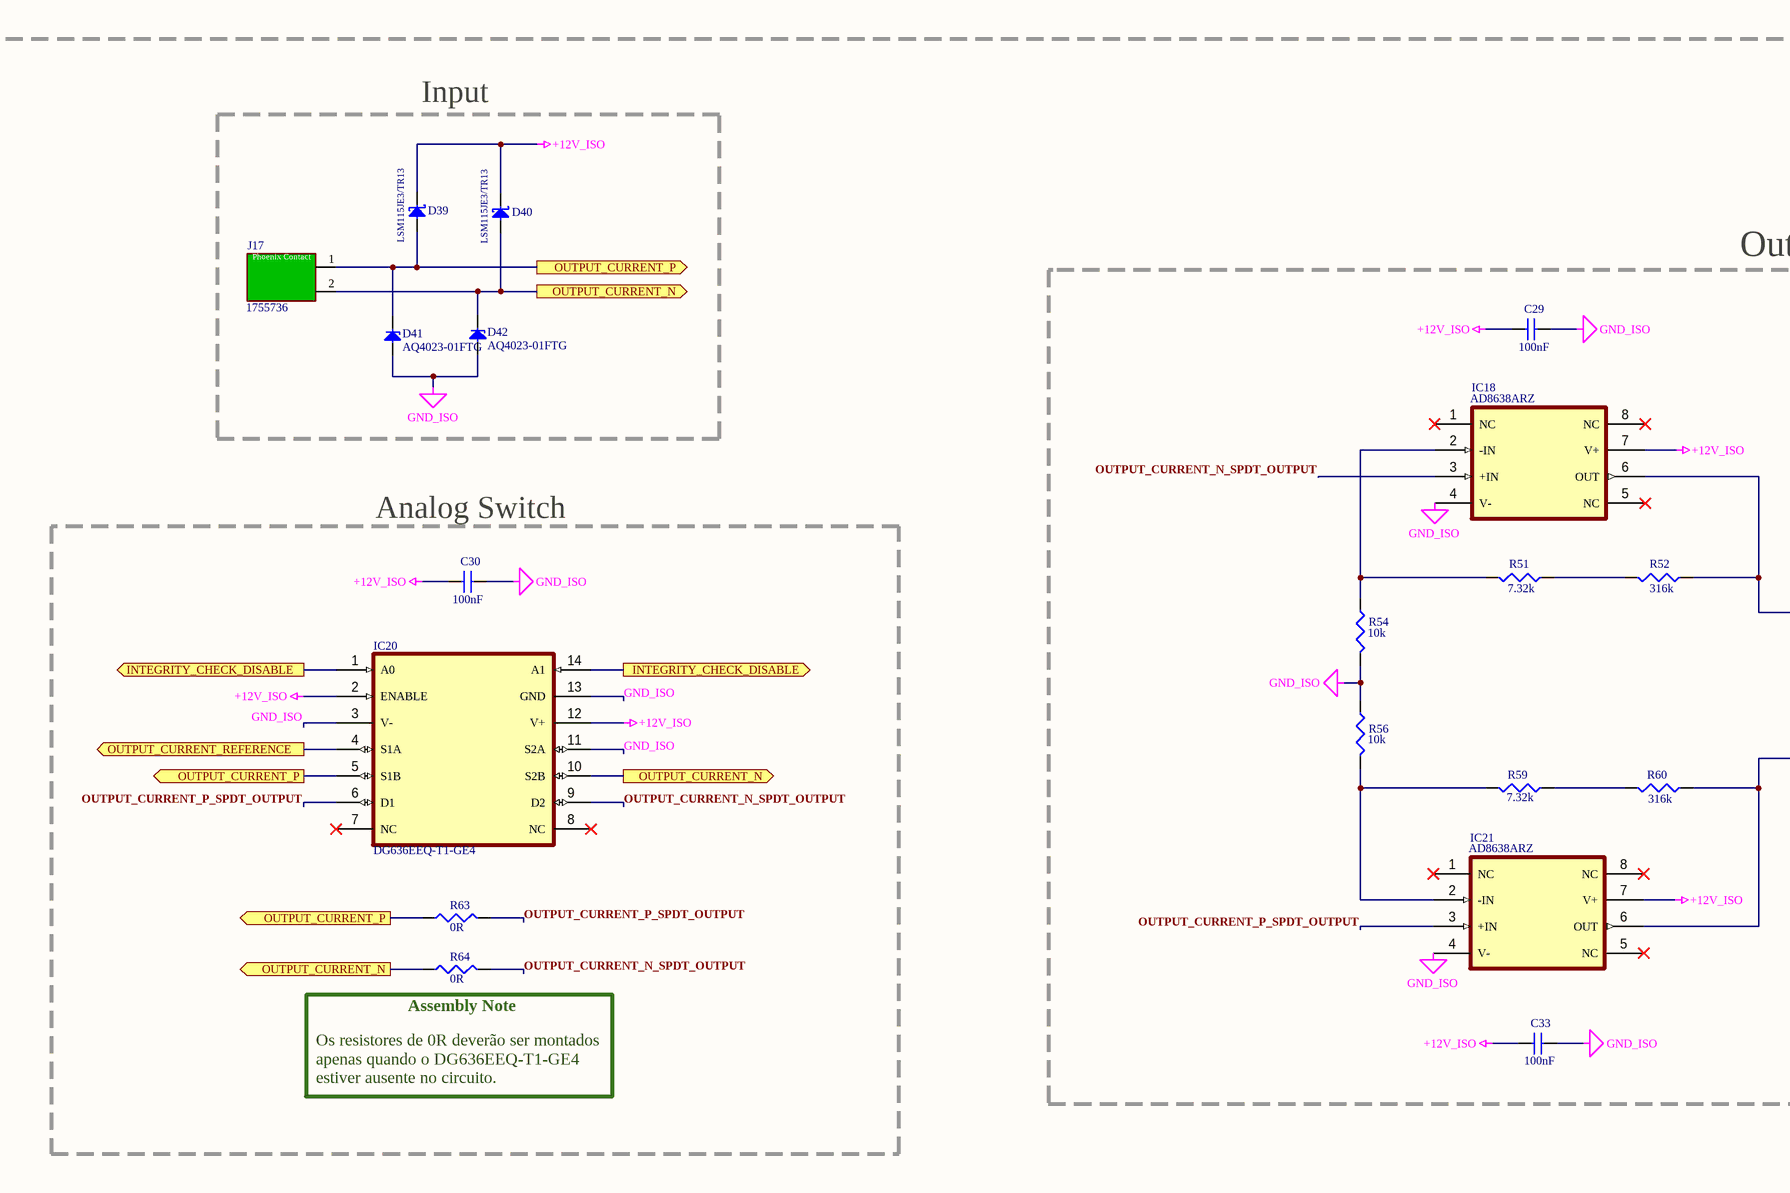
[diagram p7: measurement-output-hw.SchDoc, bottom left]
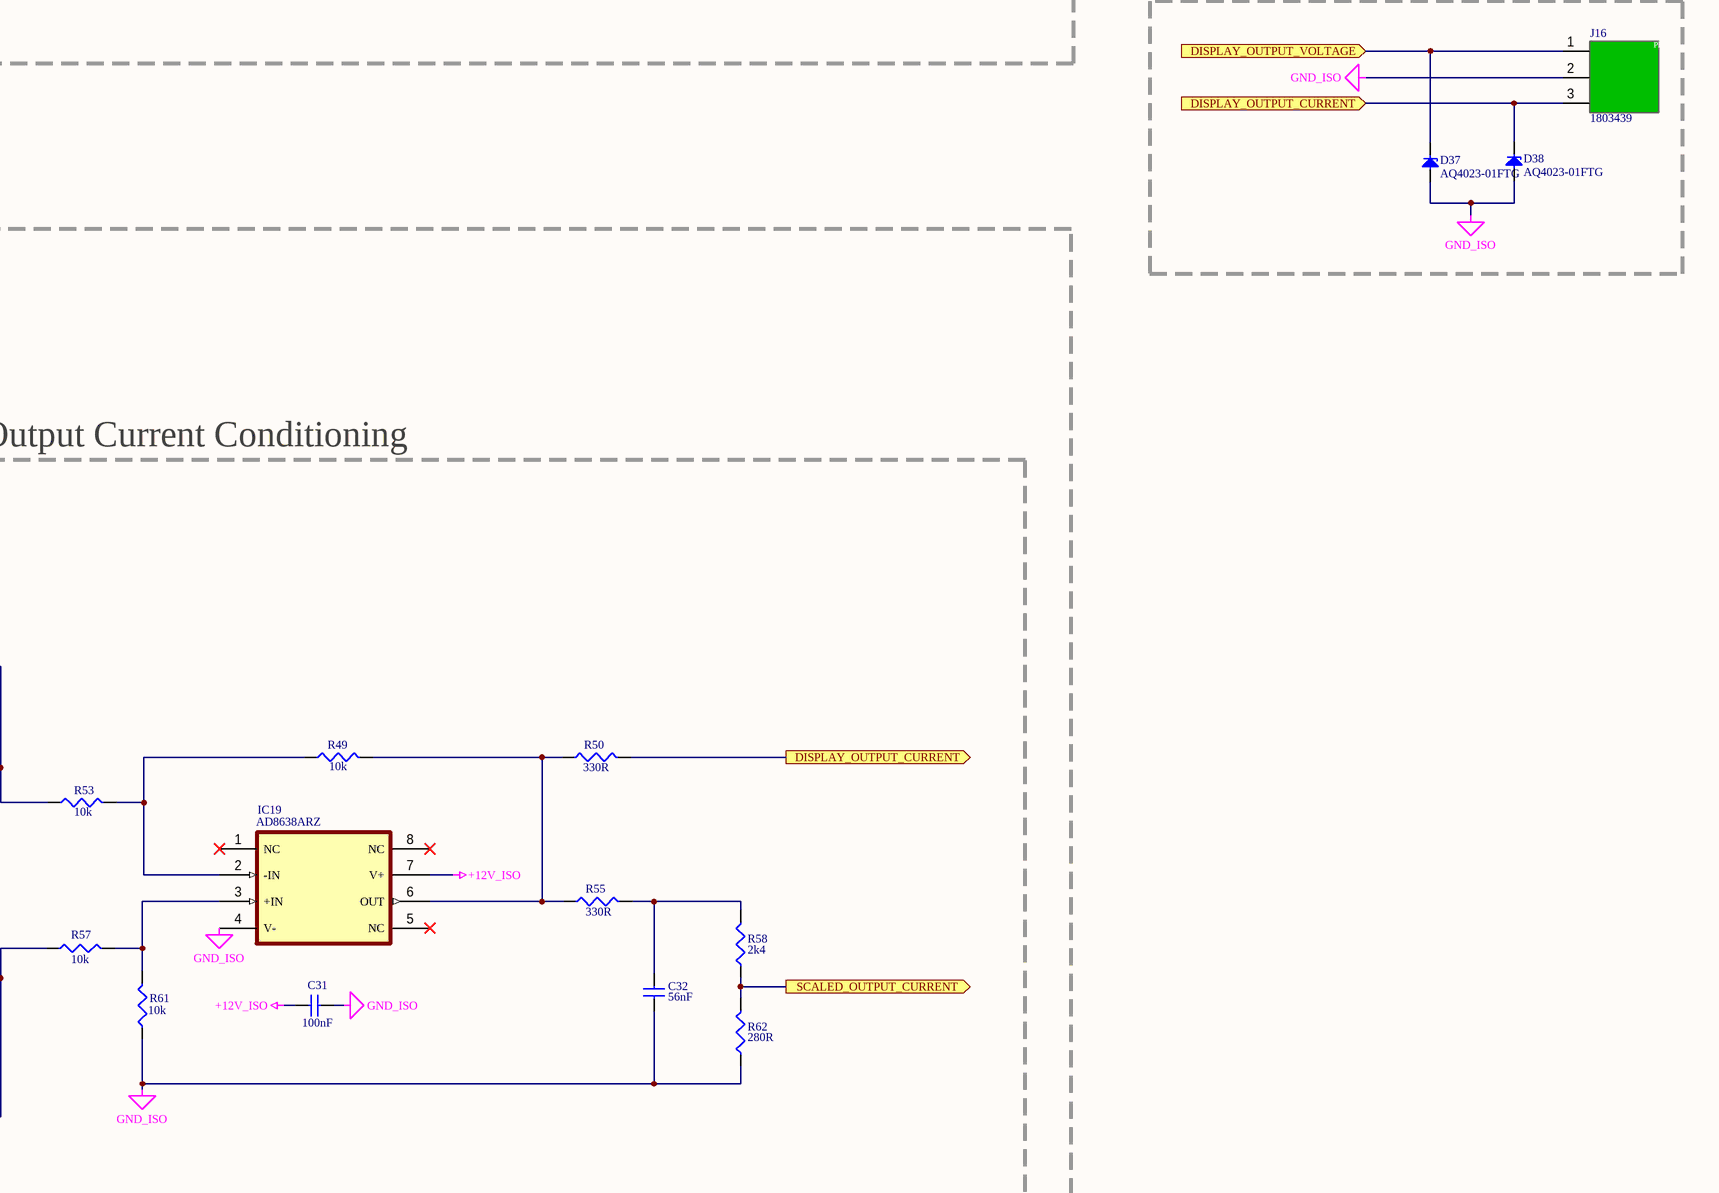
[diagram p8: measurement-output-hw.SchDoc, bottom right]

### Parts
C24  100nF  [C0805]
C25  100nF  [C0805]
C26  100nF  [C0805]
C27  68nF  [C0805]
C28  100nF  [C0805]
C29  100nF  [C0805]
C30  100nF  [C0805]
C31  100nF  [C0805]
C32  56nF  [C0805]
C33  100nF  [C0805]
D33  LSM115JE3/TR13  [DO-214BA]
D34  LSM115JE3/TR13  [DO-214BA]
D35  AQ4023-01FTG  [SOD-323]
D36  AQ4023-01FTG  [SOD-323]
D37  AQ4023-01FTG  [SOD-323]
D38  AQ4023-01FTG  [SOD-323]
D39  LSM115JE3/TR13  [DO-214BA]
D40  LSM115JE3/TR13  [DO-214BA]
D41  AQ4023-01FTG  [SOD-323]
D42  AQ4023-01FTG  [SOD-323]
IC14  AD8638ARZ  [SOIC-8]
IC15  AD8638ARZ  [SOIC-8]
IC16  AD8638ARZ  [SOIC-8]
IC17  DG636EEQ-T1-GE4  [TSSOP-14]
IC18  AD8638ARZ  [SOIC-8]
IC19  AD8638ARZ  [SOIC-8]
IC20  DG636EEQ-T1-GE4  [TSSOP-14]
IC21  AD8638ARZ  [SOIC-8]
J15  1755736  [Conector 2 vias]
J16  1803439  [Conector Phoenix 3 vias]
J17  1755736  [Conector 2 vias]
R39  10k  [Resistor 0805]
R40  330R  [Resistor 0805]
R41  100k  [Resistor 0805]
R42  330R  [Resistor 0805]
R43  100k  [Resistor 0805]
R44  650R  [Resistor 0805]
R45  10k  [Resistor 0805]
R46  280R  [Resistor 0805]
R47  0R  [Resistor 0805]
R48  0R  [Resistor 0805]
R49  10k  [Resistor 0805]
R50  330R  [Resistor 0805]
R51  7.32k  [Resistor 0805]
R52  316k  [Resistor 0805]
R53  10k  [Resistor 0805]
R54  10k  [Resistor 0805]
R55  330R  [Resistor 0805]
R56  10k  [Resistor 0805]
R57  10k  [Resistor 0805]
R58  2k4  [Resistor 0805]
R59  7.32k  [Resistor 0805]
R60  316k  [Resistor 0805]
R61  10k  [Resistor 0805]
R62  280R  [Resistor 0805]
R63  0R  [Resistor 0805]
R64  0R  [Resistor 0805]

### Blocks framed on the sheet
Input: D33-D36 J15
Output Voltage Conditioning: C24 C25 C27 C28 IC14-IC16 R39-R46
Analog Switch: C26 IC17 R47 R48
To Rotary Switch: D37 D38 J16
Input: D39-D42 J17
Output Current Conditioning: C29 C31-C33 IC18 IC19 IC21 R49-R62
Analog Switch: C30 IC20 R63 R64

### Ports
DISPLAY_OUTPUT_CURRENT (in, see measurement-output-hw[9C]), DISPLAY_OUTPUT_CURRENT (out, see measurement-output-hw[10C]), DISPLAY_OUTPUT_VOLTAGE (in, see measurement-output-hw[9A]), DISPLAY_OUTPUT_VOLTAGE (out, see measurement-output-hw[10B]), INTEGRITY_CHECK_DISABLE (out, see calibration-hw[5B], measurement-output-hw[2B], measurement-output-hw[2D], measurement-output-hw[4B], measurement-ps1-hw[1C], measurement-ps1-hw[3C], measurement-ps2-hw[1B], measurement-ps2-hw[3B], measurement-ps3-hw[1B], measurement-ps3-hw[3B]), INTEGRITY_CHECK_DISABLE (out, see calibration-hw[5B], measurement-output-hw[2B], measurement-output-hw[2D], measurement-output-hw[4D], measurement-ps1-hw[1C], measurement-ps1-hw[3C], measurement-ps2-hw[1B], measurement-ps2-hw[3B], measurement-ps3-hw[1B], measurement-ps3-hw[3B]), INTEGRITY_CHECK_DISABLE (out, see calibration-hw[5B], measurement-output-hw[2B], measurement-output-hw[4B], measurement-output-hw[4D], measurement-ps1-hw[1C], measurement-ps1-hw[3C], measurement-ps2-hw[1B], measurement-ps2-hw[3B], measurement-ps3-hw[1B], measurement-ps3-hw[3B]), INTEGRITY_CHECK_DISABLE (out, see calibration-hw[5B], measurement-output-hw[2D], measurement-output-hw[4B], measurement-output-hw[4D], measurement-ps1-hw[1C], measurement-ps1-hw[3C], measurement-ps2-hw[1B], measurement-ps2-hw[3B], measurement-ps3-hw[1B], measurement-ps3-hw[3B]), OUTPUT_CURRENT_N (out, see measurement-output-hw[3C], measurement-output-hw[3D]), OUTPUT_CURRENT_N (out, see measurement-output-hw[3C], measurement-output-hw[4D]), OUTPUT_CURRENT_N (out, see measurement-output-hw[3D], measurement-output-hw[4D]), OUTPUT_CURRENT_P (out, see measurement-output-hw[2D], measurement-output-hw[3C]), OUTPUT_CURRENT_P (out, see measurement-output-hw[2D], measurement-output-hw[3D]), OUTPUT_CURRENT_P (out, see measurement-output-hw[3C], measurement-output-hw[3D]), OUTPUT_CURRENT_REFERENCE (out, see calibration-hw[2B]), OUTPUT_VOLTAGE_N (out, see measurement-output-hw[3A], measurement-output-hw[3B]), OUTPUT_VOLTAGE_N (out, see measurement-output-hw[3A], measurement-output-hw[4B]), OUTPUT_VOLTAGE_N (out, see measurement-output-hw[3B], measurement-output-hw[4B]), OUTPUT_VOLTAGE_P (out, see measurement-output-hw[2B], measurement-output-hw[3A]), OUTPUT_VOLTAGE_P (out, see measurement-output-hw[2B], measurement-output-hw[3B]), OUTPUT_VOLTAGE_P (out, see measurement-output-hw[3A], measurement-output-hw[3B]), OUTPUT_VOLTAGE_REFERENCE (out, see calibration-hw[2B]), SCALED_OUTPUT_CURRENT (out, see isolated-analog-interface-hw[3A]), SCALED_OUTPUT_VOLTAGE (out, see isolated-analog-interface-hw[3A])

### Nets
+12V_ISO: C24.1 C25.1 C26.1 C28.1 C29.1 C30.1 C31.1 C33.1 D33.1(C) D34.1(C) D39.1(C) D40.1(C) IC14.7(V+) IC15.7(V+) IC16.7(V+) IC17.2(ENABLE) IC17.12(V+) IC18.7(V+) IC19.7(V+) IC20.2(ENABLE) IC20.12(V+) IC21.7(V+)
GND_ISO: C24.2 C25.2 C26.2 C27.1 C28.2 C29.2 C30.2 C31.2 C32.1 C33.2 D35.2 D36.2 D37.2 D38.2 D41.2 D42.2 IC14.4(V-) IC15.4(V-) IC16.4(V-) IC17.3(V-) IC17.11(S2A) IC17.13(GND) IC18.4(V-) IC19.4(V-) IC20.3(V-) IC20.11(S2A) IC20.13(GND) IC21.4(V-) J16.2 R45.1 R46.1 R54.2 R56.1 R61.1 R62.1
OUTPUT_CURRENT_N_SPDT_OUTPUT: IC18.3(+IN) IC20.9(D2) R64.2
OUTPUT_CURRENT_P_SPDT_OUTPUT: IC20.6(D1) IC21.3(+IN) R63.2
OUTPUT_VOLTAGE_N_SPDT_OUTPUT: IC14.3(+IN) IC17.9(D2) R48.2
OUTPUT_VOLTAGE_P_SPDT_OUTPUT: IC16.3(+IN) IC17.6(D1) R47.2
NetC27_2: C27.2 R42.2 R44.2
NetC32_2: C32.2 R55.2 R58.2
NetD33_2: D33.2(A) D35.1 IC17.5(S1B) J15.1 R47.1 ; port OUTPUT_VOLTAGE_P
NetD34_2: D34.2(A) D36.1 IC17.10(S2B) J15.2 R48.1 ; port OUTPUT_VOLTAGE_N
NetD37_1: D37.1 J16.1 R40.2 ; port DISPLAY_OUTPUT_VOLTAGE
NetD38_1: D38.1 J16.3 R50.2 ; port DISPLAY_OUTPUT_CURRENT
NetD39_2: D39.2(A) D41.1 IC20.5(S1B) J17.1 R63.1 ; port OUTPUT_CURRENT_P
NetD40_2: D40.2(A) D42.1 IC20.10(S2B) J17.2 R64.1 ; port OUTPUT_CURRENT_N
NetIC6_1: IC17.1(A0) IC17.14(A1) IC20.1(A0) IC20.14(A1) ; port INTEGRITY_CHECK_DISABLE
NetIC14_2: IC14.2(-IN) IC14.6(OUT) R41.1
NetIC15_2: IC15.2(-IN) R39.1 R41.2
NetIC15_3: IC15.3(+IN) R43.2 R45.2
NetIC15_6: IC15.6(OUT) R39.2 R40.1 R42.1
NetIC16_2: IC16.2(-IN) IC16.6(OUT) R43.1
NetIC17_4: IC17.4(S1A) ; port OUTPUT_VOLTAGE_REFERENCE
NetIC18_2: IC18.2(-IN) R51.1 R54.1
NetIC18_6: IC18.6(OUT) R52.2 R53.1
NetIC19_2: IC19.2(-IN) R49.1 R53.2
NetIC19_3: IC19.3(+IN) R57.2 R61.2
NetIC19_6: IC19.6(OUT) R49.2 R50.1 R55.1
NetIC20_4: IC20.4(S1A) ; port OUTPUT_CURRENT_REFERENCE
NetIC21_2: IC21.2(-IN) R56.2 R59.1
NetIC21_6: IC21.6(OUT) R57.1 R60.2
NetIC28_13: R44.1 R46.2 ; port SCALED_OUTPUT_VOLTAGE
NetIC28_14: R58.1 R62.2 ; port SCALED_OUTPUT_CURRENT
NetR51_2: R51.2 R52.1
NetR59_2: R59.2 R60.1

Not connected (* = marked no-connect by the designer): IC14 1(NC)* 5(NC)* 8(NC)*; IC15 1(NC)* 5(NC)* 8(NC)*; IC16 1(NC)* 5(NC)* 8(NC)*; IC17 7(NC)* 8(NC)*; IC18 1(NC)* 5(NC)* 8(NC)*; IC19 1(NC)* 5(NC)* 8(NC)*; IC20 7(NC)* 8(NC)*; IC21 1(NC)* 5(NC)* 8(NC)*

### Notes on the sheet
- [OUT] - Measurement
- (near R48) Assembly Note
- Os resistores de 0R deverão ser montados apenas quando o DG636EEQ-T1-GE4 estiver ausente no circuito.
- (near R64) Assembly Note
- Title:
- Drawn by:
- Revision:
- Copyright CNPEM 2023.
  This documentation describes Open Hardware and is licensed under the CERN OHL S v2. You may redistribute and modify this documentation under the terms of the CERN OHL S v2. (https://www.ohwr.org/cernohl). This documentation is distributed WITHOUT ANY EXPRESS OR IMPLIED WARRANTY, INCLUDING OF MERCHANTABILITY, SATISFACTORY QUALITY AND FITNESS FOR A PARTICULAR PURPOSE. Please see the CERN OHL S v2 for applicable conditions.
- File:
- Date:
- Project:
- Time:
- Sheet
- of
- ENT - AIS - SEI
  Sistemas Eletrônicos e
  Instrumentação
- (in symbol Conector Phoenix 3 vias) Phoenix Contact
- (in symbol Phoenix 1755736) Phoenix Contact

### Library data of the parts
C24-C26 C28-C31 C33 = Capacitor 100nF
C27 = Capacitor 68nF
C32 = Capacitor 56nF
D33 D34 D39 D40 = LSM115JE3/TR13: DIODE SCHOTTKY 15V, 1A, DO214BA
D35-D38 D41 D42 = AQ4023-01FTG: Unidirectional TVS DIode, 12A, 1.3pF
IC14-IC16 IC18 IC19 IC21 = AD8638ARZ: as IC29 on sheet isolated-analog-interface-hw
IC17 IC20 = DG636EEQ-T1-GE4: Analog Switch Dual-SPDT, 14 pins; Supplier 1: Newark; Supplier Part Number 1: 56AJ9808
J15 J17 = Phoenix 1755736: Term Block HDR 2POS VERT 5.08MM
J16 = Conector Phoenix 3 vias
R39 R45 R49 R53 R54 R56 R57 R61 = Resistor 10k
R40 R42 R50 R55 = Resistor 330R
R41 R43 = Resistor 100k
R44 = Resistor 650R
R46 R62 = Resistor 280R
R47 R48 R63 R64 = Resistor 0R - 0805: Size 0805
R51 R59 = Resistor 7.32k
R52 R60 = Resistor 316k
R58 = Resistor 2k4

## Sheet measurement-ps1-hw.SchDoc
size A2; SheetNumber: 6; SheetTotal: 10
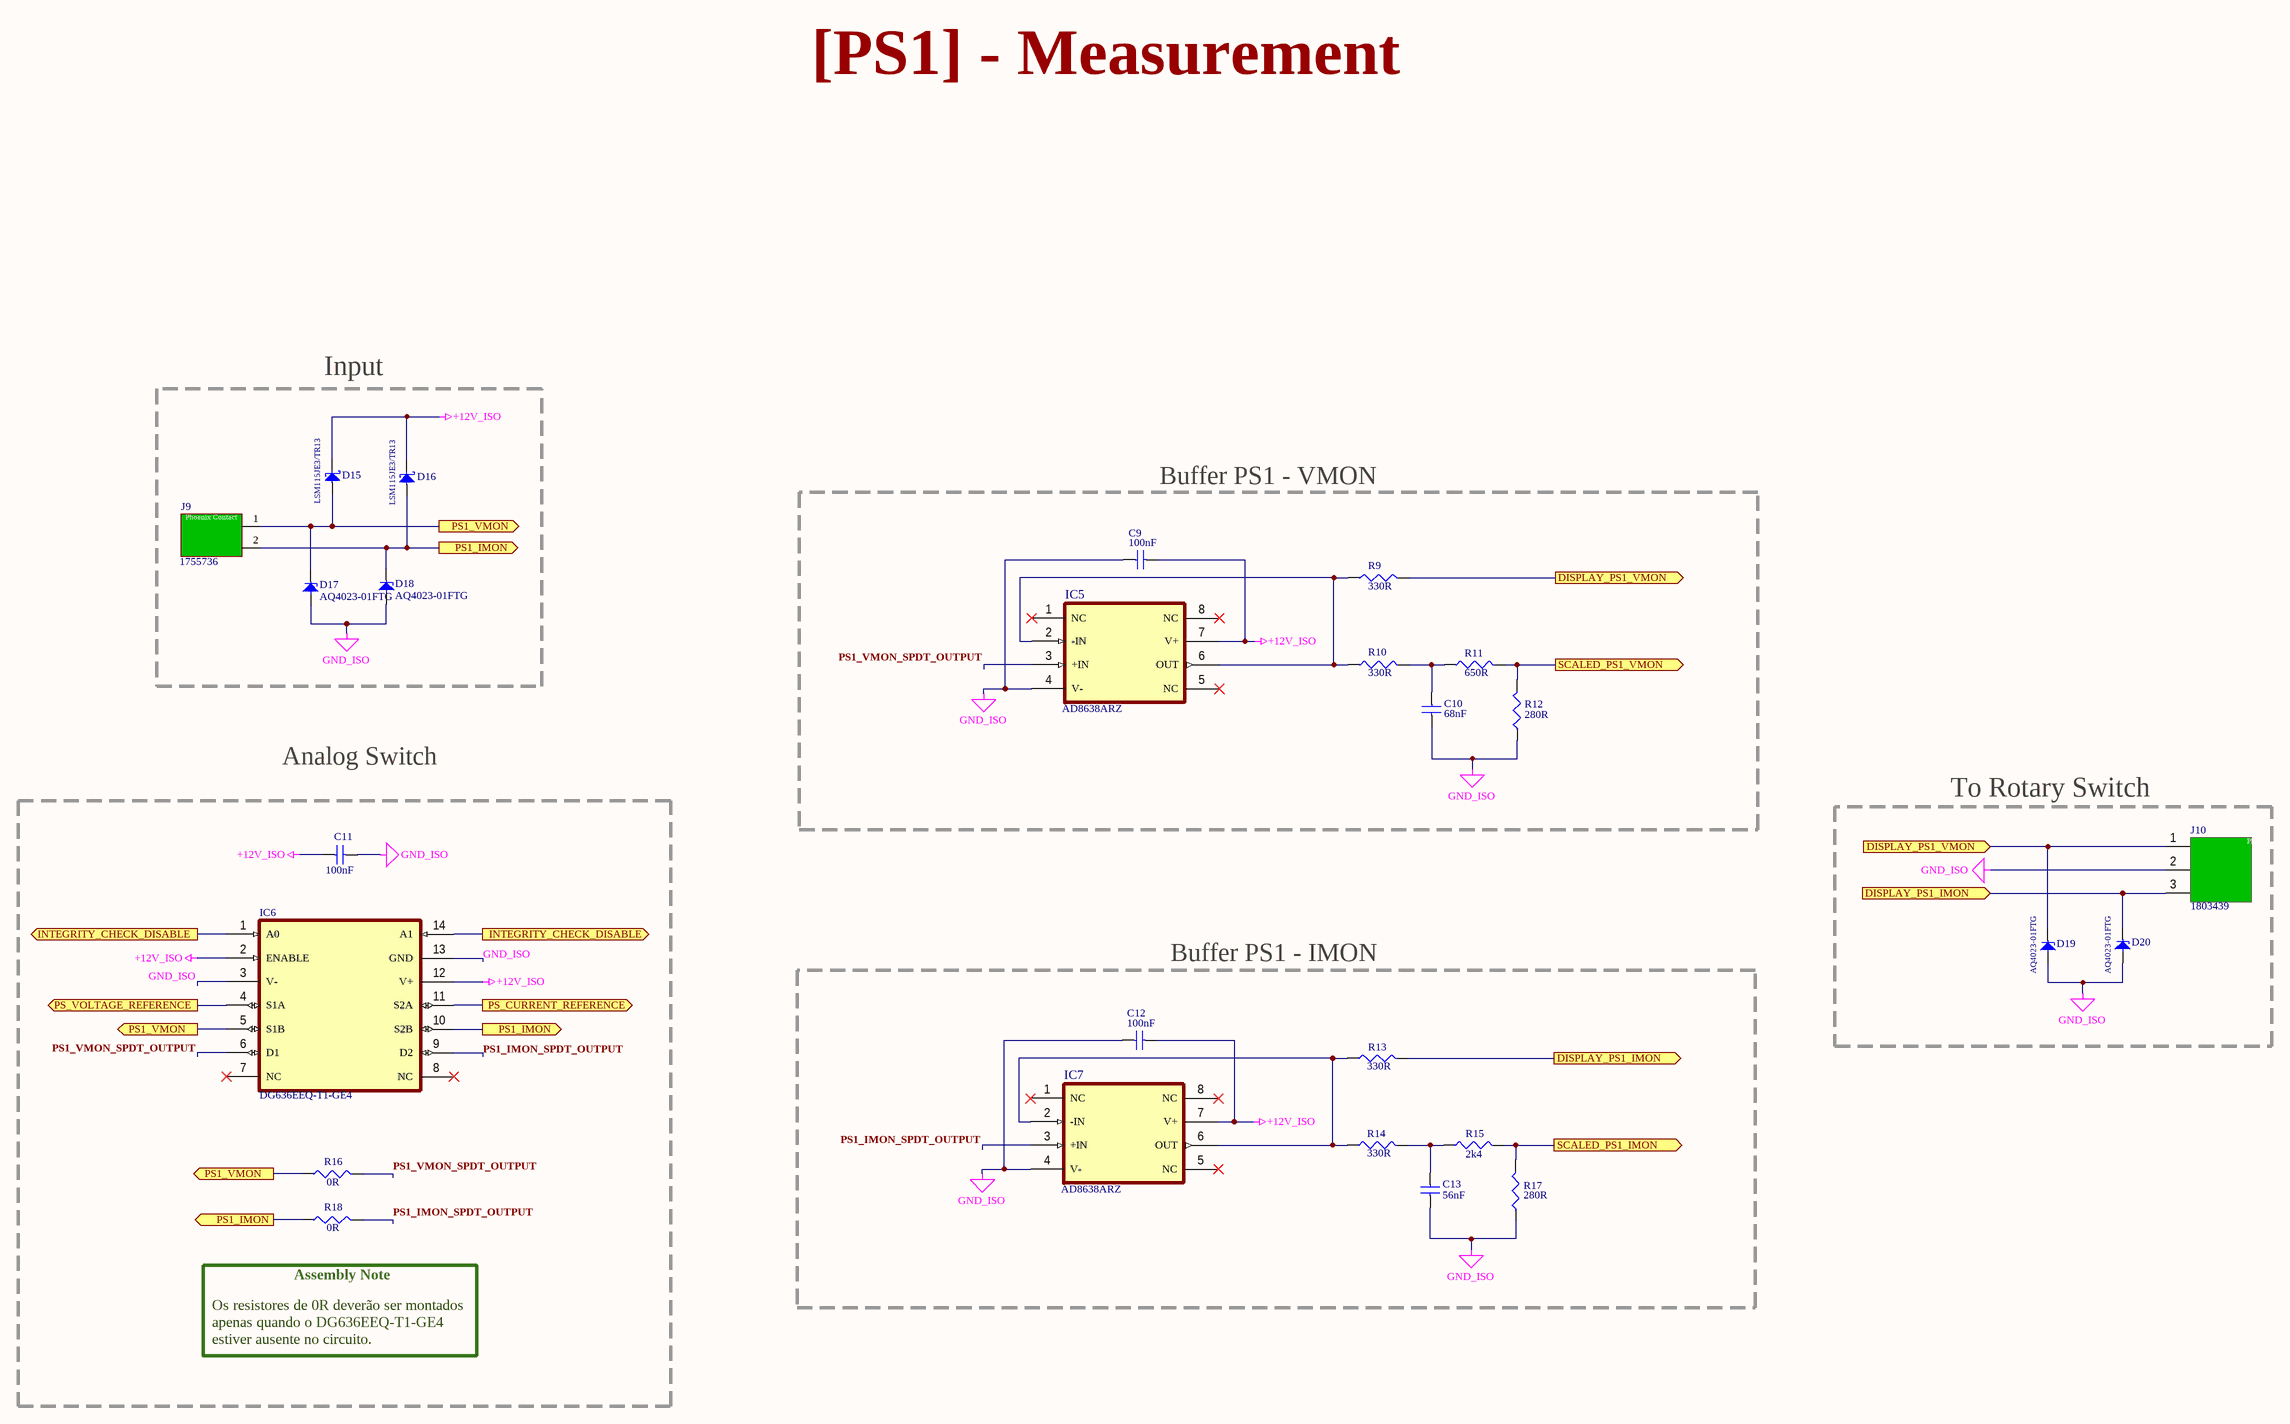
[diagram p9: measurement-ps1-hw.SchDoc]

### Parts
C9  100nF  [C0805]
C10  68nF  [C0805]
C11  100nF  [C0805]
C12  100nF  [C0805]
C13  56nF  [C0805]
D15  LSM115JE3/TR13  [DO-214BA]
D16  LSM115JE3/TR13  [DO-214BA]
D17  AQ4023-01FTG  [SOD-323]
D18  AQ4023-01FTG  [SOD-323]
D19  AQ4023-01FTG  [SOD-323]
D20  AQ4023-01FTG  [SOD-323]
IC5  AD8638ARZ  [SOIC-8]
IC6  DG636EEQ-T1-GE4  [TSSOP-14]
IC7  AD8638ARZ  [SOIC-8]
J9  1755736  [Conector 2 vias]
J10  1803439  [Conector Phoenix 3 vias]
R9  330R  [Resistor 0805]
R10  330R  [Resistor 0805]
R11  650R  [Resistor 0805]
R12  280R  [Resistor 0805]
R13  330R  [Resistor 0805]
R14  330R  [Resistor 0805]
R15  2k4  [Resistor 0805]
R16  0R  [Resistor 0805]
R17  280R  [Resistor 0805]
R18  0R  [Resistor 0805]

### Blocks framed on the sheet
Input: D15-D18 J9
Buffer PS1 - VMON: C9 C10 IC5 R9-R12
Assembly Note: C11 IC6 R16 R18
To Rotary Switch: D19 D20 J10
Buffer PS1 - IMON: C12 C13 IC7 R13-R15 R17

### Ports
DISPLAY_PS1_IMON (in, see measurement-ps1-hw[6C]), DISPLAY_PS1_IMON (out, see measurement-ps1-hw[7B]), DISPLAY_PS1_VMON (in, see measurement-ps1-hw[6B]), DISPLAY_PS1_VMON (out, see measurement-ps1-hw[7B]), INTEGRITY_CHECK_DISABLE (out, see calibration-hw[5B], measurement-output-hw[2B], measurement-output-hw[2D], measurement-output-hw[4B], measurement-output-hw[4D], measurement-ps1-hw[1C], measurement-ps2-hw[1B], measurement-ps2-hw[3B], measurement-ps3-hw[1B], measurement-ps3-hw[3B]), INTEGRITY_CHECK_DISABLE (out, see calibration-hw[5B], measurement-output-hw[2B], measurement-output-hw[2D], measurement-output-hw[4B], measurement-output-hw[4D], measurement-ps1-hw[3C], measurement-ps2-hw[1B], measurement-ps2-hw[3B], measurement-ps3-hw[1B], measurement-ps3-hw[3B]), PS1_IMON (out, see measurement-ps1-hw[2B], measurement-ps1-hw[2C]), PS1_IMON (out, see measurement-ps1-hw[2B], measurement-ps1-hw[3C]), PS1_IMON (out, see measurement-ps1-hw[2C], measurement-ps1-hw[3C]), PS1_VMON (out, see measurement-ps1-hw[1C], measurement-ps1-hw[2B]), PS1_VMON (out, see measurement-ps1-hw[1C], measurement-ps1-hw[2C]), PS1_VMON (out, see measurement-ps1-hw[2B], measurement-ps1-hw[2C]), PS_CURRENT_REFERENCE (out, see calibration-hw[2C], measurement-ps2-hw[3C], measurement-ps3-hw[3C]), PS_VOLTAGE_REFERENCE (out, see calibration-hw[2C], measurement-ps2-hw[1C], measurement-ps3-hw[1C]), SCALED_PS1_IMON (out, see isolated-analog-interface-hw[3B]), SCALED_PS1_VMON (out, see isolated-analog-interface-hw[3A])

### Nets
+12V_ISO: C9.2 C11.1 C12.2 D15.1(C) D16.1(C) IC5.7(V+) IC6.2(ENABLE) IC6.12(V+) IC7.7(V+)
GND_ISO: C9.1 C10.1 C11.2 C12.1 C13.1 D17.2 D18.2 D19.2 D20.2 IC5.4(V-) IC6.3(V-) IC6.13(GND) IC7.4(V-) J10.2 R12.1 R17.1
PS1_IMON_SPDT_OUTPUT: IC6.9(D2) IC7.3(+IN) R18.2
PS1_VMON_SPDT_OUTPUT: IC5.3(+IN) IC6.6(D1) R16.2
NetC10_2: C10.2 R10.2 R11.1
NetC13_2: C13.2 R14.2 R15.1
NetD15_2: D15.2(A) D17.1 IC6.5(S1B) J9.1 R16.1 ; port PS1_VMON
NetD16_2: D16.2(A) D18.1 IC6.10(S2B) J9.2 R18.1 ; port PS1_IMON
NetD19_1: D19.1 J10.1 R9.2 ; port DISPLAY_PS1_VMON
NetD20_1: D20.1 J10.3 R13.2 ; port DISPLAY_PS1_IMON
NetIC5_2: IC5.2(-IN) IC5.6(OUT) R9.1 R10.1
NetIC6_1: IC6.1(A0) IC6.14(A1) ; port INTEGRITY_CHECK_DISABLE
NetIC6_4: IC6.4(S1A) ; port PS_VOLTAGE_REFERENCE
NetIC6_11: IC6.11(S2A) ; port PS_CURRENT_REFERENCE
NetIC7_2: IC7.2(-IN) IC7.6(OUT) R13.1 R14.1
NetIC28_12: R15.2 R17.2 ; port SCALED_PS1_IMON
NetIC28_15: R11.2 R12.2 ; port SCALED_PS1_VMON

Not connected (* = marked no-connect by the designer): IC5 1(NC)* 5(NC)* 8(NC)*; IC6 7(NC)* 8(NC)*; IC7 1(NC)* 5(NC)* 8(NC)*

### Notes on the sheet
- [PS1] - Measurement
- Analog Switch
- Os resistores de 0R deverão ser montados apenas quando o DG636EEQ-T1-GE4 estiver ausente no circuito.
- Title:
- Drawn by:
- Revision:
- Copyright CNPEM 2023.
  This documentation describes Open Hardware and is licensed under the CERN OHL S v2. You may redistribute and modify this documentation under the terms of the CERN OHL S v2. (https://www.ohwr.org/cernohl). This documentation is distributed WITHOUT ANY EXPRESS OR IMPLIED WARRANTY, INCLUDING OF MERCHANTABILITY, SATISFACTORY QUALITY AND FITNESS FOR A PARTICULAR PURPOSE. Please see the CERN OHL S v2 for applicable conditions.
- File:
- Date:
- Project:
- Time:
- Sheet
- of
- ENT - AIS - SEI
  Sistemas Eletrônicos e
  Instrumentação
- (in symbol Conector Phoenix 3 vias) Phoenix Contact
- (in symbol Phoenix 1755736) Phoenix Contact

### Library data of the parts
C9 C11 C12 = Capacitor 100nF
C10 = Capacitor 68nF
C13 = Capacitor 56nF
D15 D16 = LSM115JE3/TR13: DIODE SCHOTTKY 15V, 1A, DO214BA
D17-D20 = AQ4023-01FTG: Unidirectional TVS DIode, 12A, 1.3pF
IC5 IC7 = AD8638ARZ: as IC29 on sheet isolated-analog-interface-hw
IC6 = DG636EEQ-T1-GE4: Analog Switch Dual-SPDT, 14 pins; Supplier 1: Newark; Supplier Part Number 1: 56AJ9808
J9 = Phoenix 1755736: Term Block HDR 2POS VERT 5.08MM
J10 = Conector Phoenix 3 vias
R9 R10 R13 R14 = Resistor 330R
R11 = Resistor 650R
R12 R17 = Resistor 280R
R15 = Resistor 2k4
R16 R18 = Resistor 0R - 0805: Size 0805

## Sheet measurement-ps2-hw.SchDoc
size A2; SheetNumber: 7; SheetTotal: 10
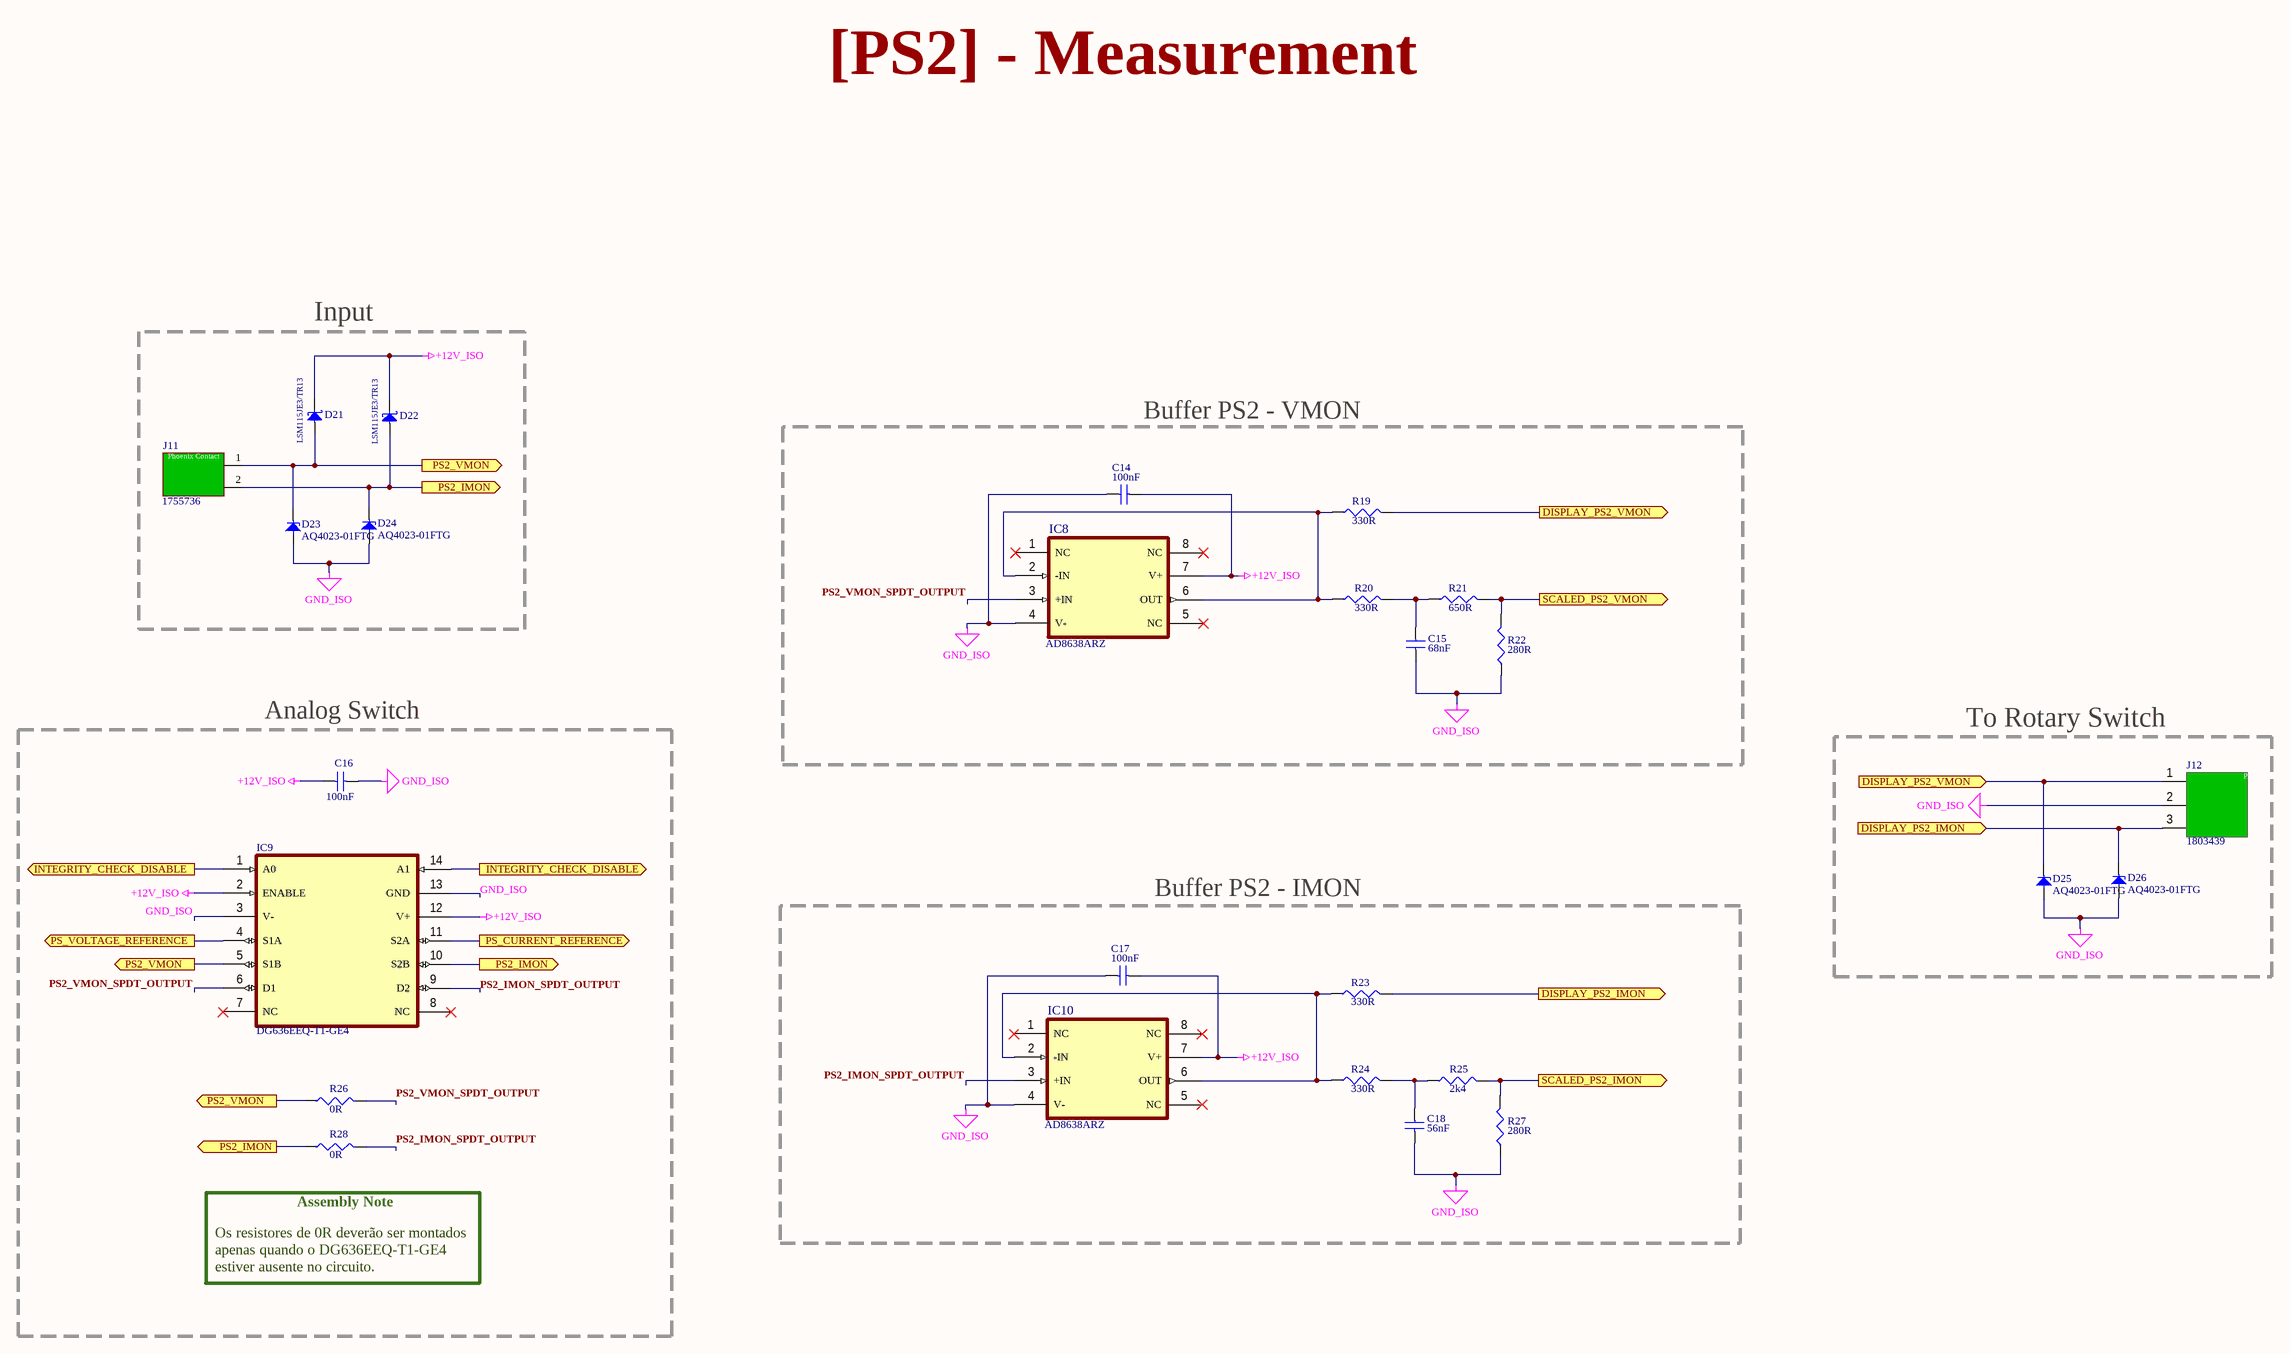
[diagram p10: measurement-ps2-hw.SchDoc]

### Parts
C14  100nF  [C0805]
C15  68nF  [C0805]
C16  100nF  [C0805]
C17  100nF  [C0805]
C18  56nF  [C0805]
D21  LSM115JE3/TR13  [DO-214BA]
D22  LSM115JE3/TR13  [DO-214BA]
D23  AQ4023-01FTG  [SOD-323]
D24  AQ4023-01FTG  [SOD-323]
D25  AQ4023-01FTG  [SOD-323]
D26  AQ4023-01FTG  [SOD-323]
IC8  AD8638ARZ  [SOIC-8]
IC9  DG636EEQ-T1-GE4  [TSSOP-14]
IC10  AD8638ARZ  [SOIC-8]
J11  1755736  [Conector 2 vias]
J12  1803439  [Conector Phoenix 3 vias]
R19  330R  [Resistor 0805]
R20  330R  [Resistor 0805]
R21  650R  [Resistor 0805]
R22  280R  [Resistor 0805]
R23  330R  [Resistor 0805]
R24  330R  [Resistor 0805]
R25  2k4  [Resistor 0805]
R26  0R  [Resistor 0805]
R27  280R  [Resistor 0805]
R28  0R  [Resistor 0805]

### Blocks framed on the sheet
Input: D21-D24 J11
Buffer PS2 - VMON: C14 C15 IC8 R19-R22
Analog Switch: C16 IC9 R26 R28
To Rotary Switch: D25 D26 J12
Buffer PS2 - IMON: C17 C18 IC10 R23-R25 R27

### Ports
DISPLAY_PS2_IMON (in, see measurement-ps2-hw[6C]), DISPLAY_PS2_IMON (out, see measurement-ps2-hw[7B]), DISPLAY_PS2_VMON (in, see measurement-ps2-hw[6B]), DISPLAY_PS2_VMON (out, see measurement-ps2-hw[7B]), INTEGRITY_CHECK_DISABLE (out, see calibration-hw[5B], measurement-output-hw[2B], measurement-output-hw[2D], measurement-output-hw[4B], measurement-output-hw[4D], measurement-ps1-hw[1C], measurement-ps1-hw[3C], measurement-ps2-hw[1B], measurement-ps3-hw[1B], measurement-ps3-hw[3B]), INTEGRITY_CHECK_DISABLE (out, see calibration-hw[5B], measurement-output-hw[2B], measurement-output-hw[2D], measurement-output-hw[4B], measurement-output-hw[4D], measurement-ps1-hw[1C], measurement-ps1-hw[3C], measurement-ps2-hw[3B], measurement-ps3-hw[1B], measurement-ps3-hw[3B]), PS2_IMON (out, see measurement-ps2-hw[2C], measurement-ps2-hw[3B]), PS2_IMON (out, see measurement-ps2-hw[2C], measurement-ps2-hw[3C]), PS2_IMON (out, see measurement-ps2-hw[3B], measurement-ps2-hw[3C]), PS2_VMON (out, see measurement-ps2-hw[2C]), PS2_VMON (out, see measurement-ps2-hw[2C], measurement-ps2-hw[3B]), PS_CURRENT_REFERENCE (out, see calibration-hw[2C], measurement-ps1-hw[3C], measurement-ps3-hw[3C]), PS_VOLTAGE_REFERENCE (out, see calibration-hw[2C], measurement-ps1-hw[1C], measurement-ps3-hw[1C]), SCALED_PS2_IMON (out, see isolated-analog-interface-hw[3B]), SCALED_PS2_VMON (out, see isolated-analog-interface-hw[3B])

### Nets
+12V_ISO: C14.2 C16.1 C17.2 D21.1(C) D22.1(C) IC8.7(V+) IC9.2(ENABLE) IC9.12(V+) IC10.7(V+)
GND_ISO: C14.1 C15.1 C16.2 C17.1 C18.1 D23.2 D24.2 D25.2 D26.2 IC8.4(V-) IC9.3(V-) IC9.13(GND) IC10.4(V-) J12.2 R22.1 R27.1
PS2_IMON_SPDT_OUTPUT: IC9.9(D2) IC10.3(+IN) R28.2
PS2_VMON_SPDT_OUTPUT: IC8.3(+IN) IC9.6(D1) R26.2
NetC15_2: C15.2 R20.2 R21.1
NetC18_2: C18.2 R24.2 R25.1
NetD21_2: D21.2(A) D23.1 IC9.5(S1B) J11.1 R26.1 ; port PS2_VMON
NetD22_2: D22.2(A) D24.1 IC9.10(S2B) J11.2 R28.1 ; port PS2_IMON
NetD25_1: D25.1 J12.1 R19.2 ; port DISPLAY_PS2_VMON
NetD26_1: D26.1 J12.3 R23.2 ; port DISPLAY_PS2_IMON
NetIC6_1: IC9.1(A0) IC9.14(A1) ; port INTEGRITY_CHECK_DISABLE
NetIC6_4: IC9.4(S1A) ; port PS_VOLTAGE_REFERENCE
NetIC6_11: IC9.11(S2A) ; port PS_CURRENT_REFERENCE
NetIC8_2: IC8.2(-IN) IC8.6(OUT) R19.1 R20.1
NetIC10_2: IC10.2(-IN) IC10.6(OUT) R23.1 R24.1
NetIC28_1: R21.2 R22.2 ; port SCALED_PS2_VMON
NetIC28_5: R25.2 R27.2 ; port SCALED_PS2_IMON

Not connected (* = marked no-connect by the designer): IC8 1(NC)* 5(NC)* 8(NC)*; IC9 7(NC)* 8(NC)*; IC10 1(NC)* 5(NC)* 8(NC)*

### Notes on the sheet
- [PS2] - Measurement
- Assembly Note
- Os resistores de 0R deverão ser montados apenas quando o DG636EEQ-T1-GE4 estiver ausente no circuito.
- Title:
- Drawn by:
- Revision:
- Copyright CNPEM 2023.
  This documentation describes Open Hardware and is licensed under the CERN OHL S v2. You may redistribute and modify this documentation under the terms of the CERN OHL S v2. (https://www.ohwr.org/cernohl). This documentation is distributed WITHOUT ANY EXPRESS OR IMPLIED WARRANTY, INCLUDING OF MERCHANTABILITY, SATISFACTORY QUALITY AND FITNESS FOR A PARTICULAR PURPOSE. Please see the CERN OHL S v2 for applicable conditions.
- File:
- Date:
- Project:
- Time:
- Sheet
- of
- ENT - AIS - SEI
  Sistemas Eletrônicos e
  Instrumentação
- (in symbol Conector Phoenix 3 vias) Phoenix Contact
- (in symbol Phoenix 1755736) Phoenix Contact

### Library data of the parts
C14 C16 C17 = Capacitor 100nF
C15 = Capacitor 68nF
C18 = Capacitor 56nF
D21 D22 = LSM115JE3/TR13: DIODE SCHOTTKY 15V, 1A, DO214BA
D23-D26 = AQ4023-01FTG: Unidirectional TVS DIode, 12A, 1.3pF
IC8 IC10 = AD8638ARZ: as IC29 on sheet isolated-analog-interface-hw
IC9 = DG636EEQ-T1-GE4: Analog Switch Dual-SPDT, 14 pins; Supplier 1: Newark; Supplier Part Number 1: 56AJ9808
J11 = Phoenix 1755736: Term Block HDR 2POS VERT 5.08MM
J12 = Conector Phoenix 3 vias
R19 R20 R23 R24 = Resistor 330R
R21 = Resistor 650R
R22 R27 = Resistor 280R
R25 = Resistor 2k4
R26 R28 = Resistor 0R - 0805: Size 0805

## Sheet measurement-ps3-hw.SchDoc
size A2; SheetNumber: 8; SheetTotal: 10
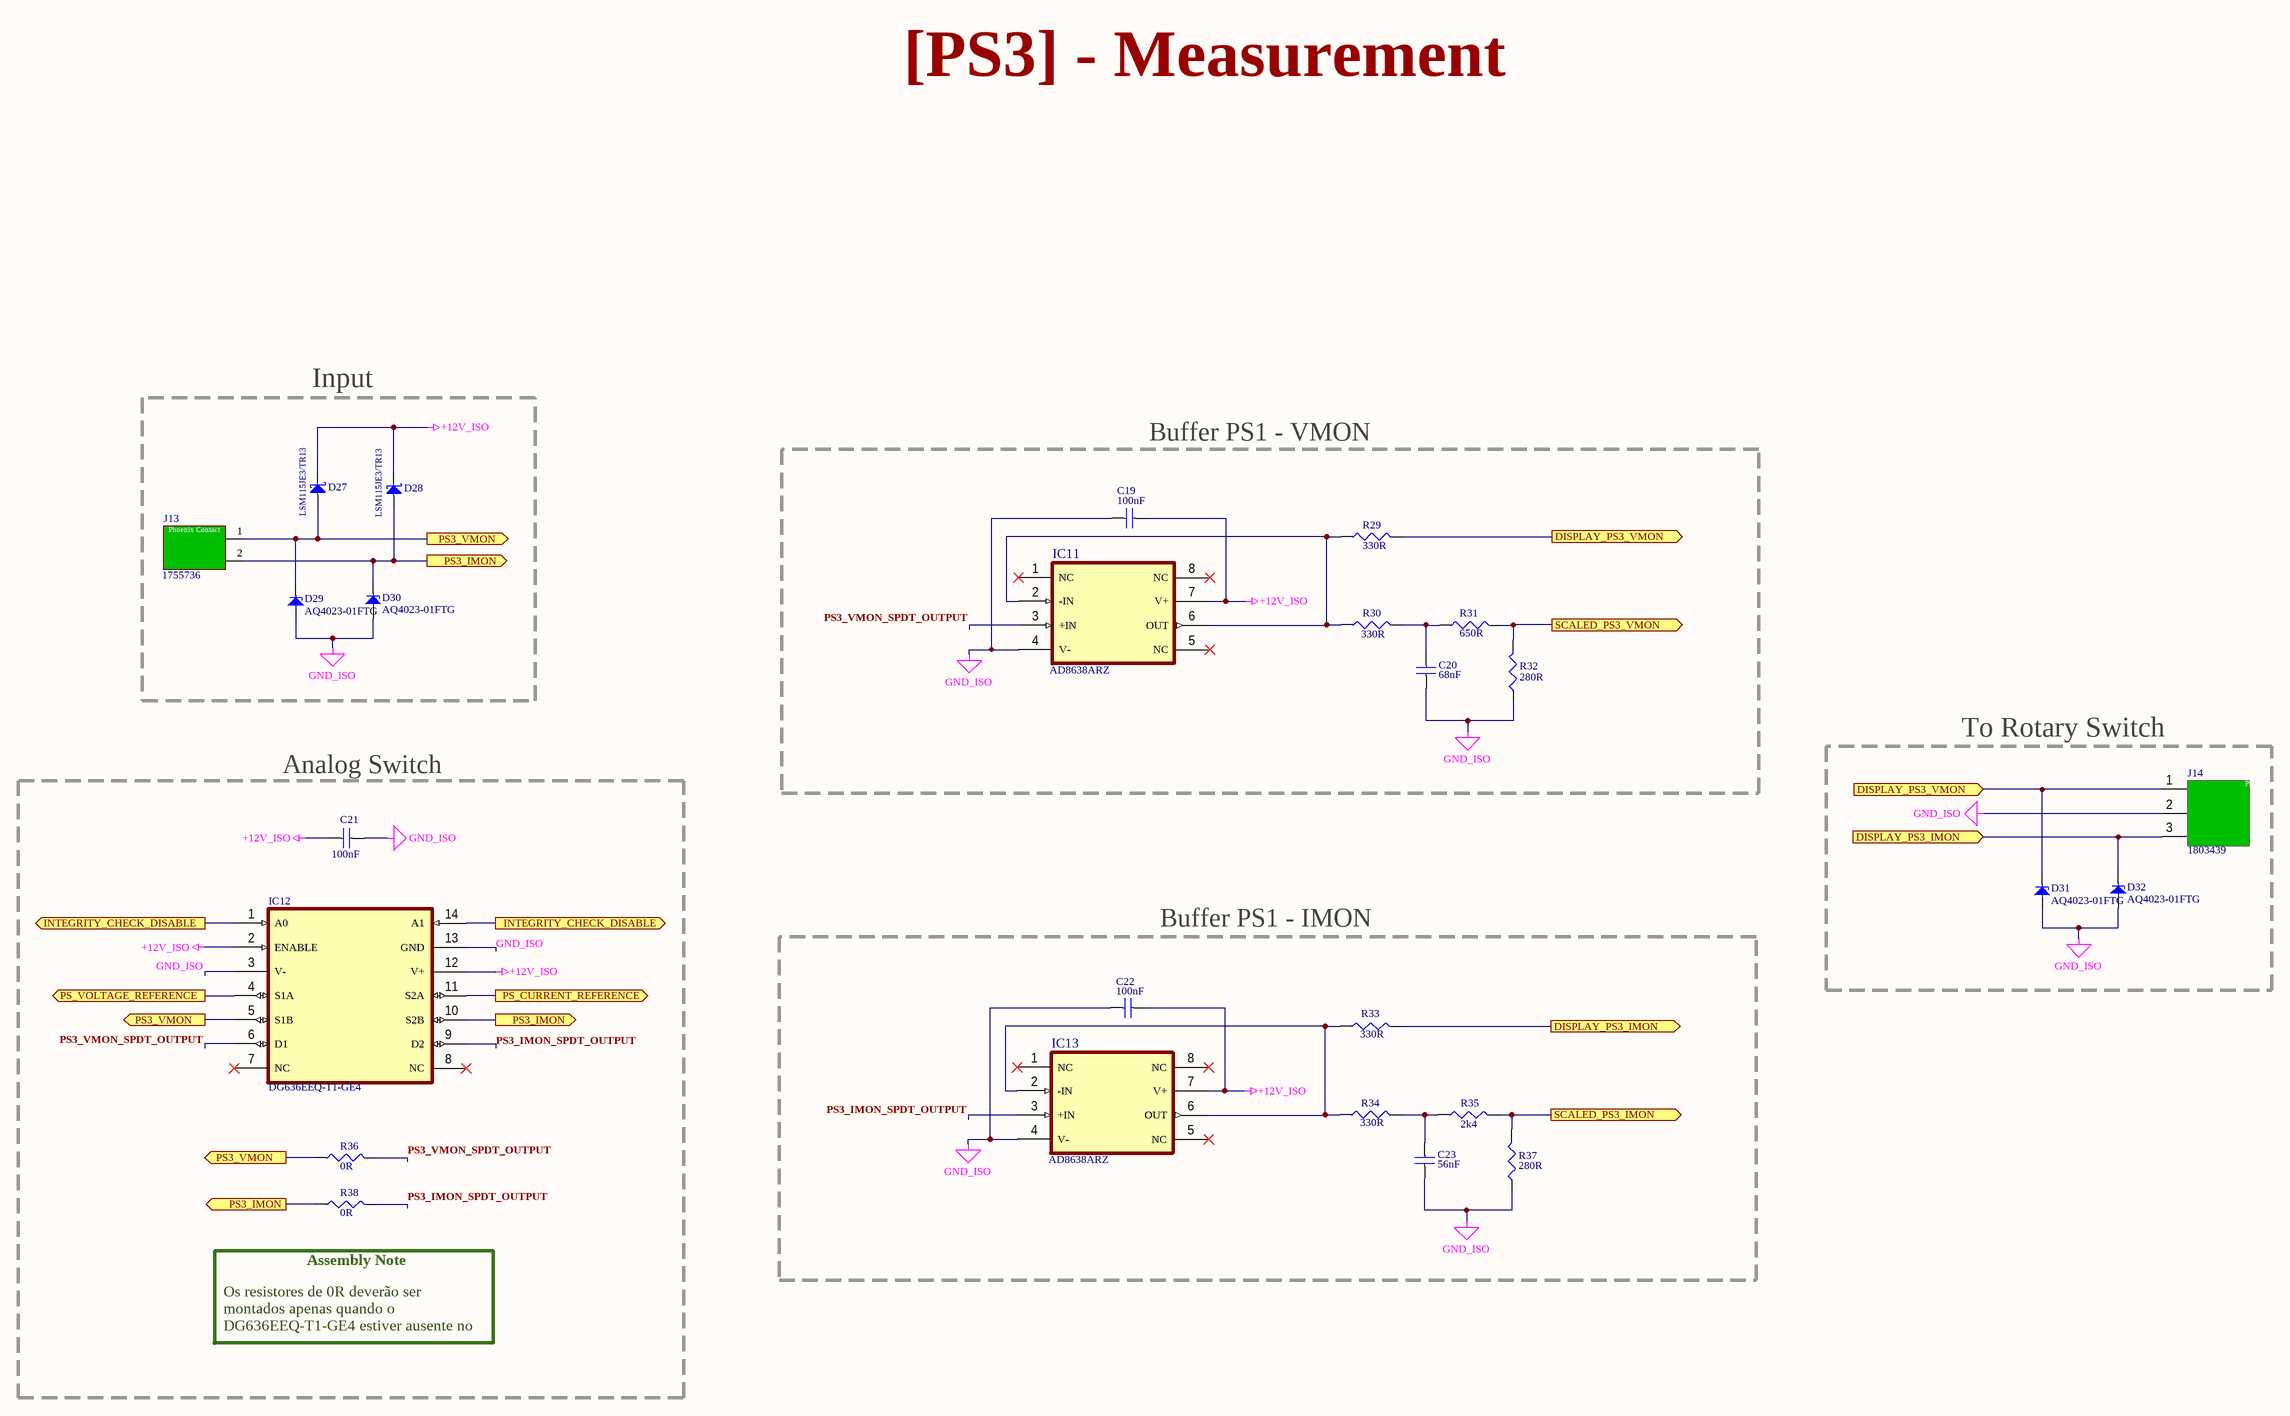
[diagram p11: measurement-ps3-hw.SchDoc]

### Parts
C19  100nF  [C0805]
C20  68nF  [C0805]
C21  100nF  [C0805]
C22  100nF  [C0805]
C23  56nF  [C0805]
D27  LSM115JE3/TR13  [DO-214BA]
D28  LSM115JE3/TR13  [DO-214BA]
D29  AQ4023-01FTG  [SOD-323]
D30  AQ4023-01FTG  [SOD-323]
D31  AQ4023-01FTG  [SOD-323]
D32  AQ4023-01FTG  [SOD-323]
IC11  AD8638ARZ  [SOIC-8]
IC12  DG636EEQ-T1-GE4  [TSSOP-14]
IC13  AD8638ARZ  [SOIC-8]
J13  1755736  [Conector 2 vias]
J14  1803439  [Conector Phoenix 3 vias]
R29  330R  [Resistor 0805]
R30  330R  [Resistor 0805]
R31  650R  [Resistor 0805]
R32  280R  [Resistor 0805]
R33  330R  [Resistor 0805]
R34  330R  [Resistor 0805]
R35  2k4  [Resistor 0805]
R36  0R  [Resistor 0805]
R37  280R  [Resistor 0805]
R38  0R  [Resistor 0805]

### Blocks framed on the sheet
Input: D27-D30 J13
Buffer PS1 - VMON: C19 C20 IC11 R29-R32
Analog Switch: C21 IC12 R36 R38
To Rotary Switch: D31 D32 J14
Buffer PS1 - IMON: C22 C23 IC13 R33-R35 R37

### Ports
DISPLAY_PS3_IMON (in, see measurement-ps3-hw[6C]), DISPLAY_PS3_IMON (out, see measurement-ps3-hw[7B]), DISPLAY_PS3_VMON (in, see measurement-ps3-hw[6B]), DISPLAY_PS3_VMON (out, see measurement-ps3-hw[7B]), INTEGRITY_CHECK_DISABLE (out, see calibration-hw[5B], measurement-output-hw[2B], measurement-output-hw[2D], measurement-output-hw[4B], measurement-output-hw[4D], measurement-ps1-hw[1C], measurement-ps1-hw[3C], measurement-ps2-hw[1B], measurement-ps2-hw[3B], measurement-ps3-hw[1B]), INTEGRITY_CHECK_DISABLE (out, see calibration-hw[5B], measurement-output-hw[2B], measurement-output-hw[2D], measurement-output-hw[4B], measurement-output-hw[4D], measurement-ps1-hw[1C], measurement-ps1-hw[3C], measurement-ps2-hw[1B], measurement-ps2-hw[3B], measurement-ps3-hw[3B]), PS3_IMON (out, see measurement-ps3-hw[2B], measurement-ps3-hw[2C]), PS3_IMON (out, see measurement-ps3-hw[2B], measurement-ps3-hw[3C]), PS3_IMON (out, see measurement-ps3-hw[2C], measurement-ps3-hw[3C]), PS3_VMON (out, see measurement-ps3-hw[2B], measurement-ps3-hw[2C]), PS3_VMON (out, see measurement-ps3-hw[2C]), PS_CURRENT_REFERENCE (out, see calibration-hw[2C], measurement-ps1-hw[3C], measurement-ps2-hw[3C]), PS_VOLTAGE_REFERENCE (out, see calibration-hw[2C], measurement-ps1-hw[1C], measurement-ps2-hw[1C]), SCALED_PS3_IMON (out, see isolated-analog-interface-hw[3B]), SCALED_PS3_VMON (out, see isolated-analog-interface-hw[3B])

### Nets
+12V_ISO: C19.2 C21.1 C22.2 D27.1(C) D28.1(C) IC11.7(V+) IC12.2(ENABLE) IC12.12(V+) IC13.7(V+)
GND_ISO: C19.1 C20.1 C21.2 C22.1 C23.1 D29.2 D30.2 D31.2 D32.2 IC11.4(V-) IC12.3(V-) IC12.13(GND) IC13.4(V-) J14.2 R32.1 R37.1
PS3_IMON_SPDT_OUTPUT: IC12.9(D2) IC13.3(+IN) R38.2
PS3_VMON_SPDT_OUTPUT: IC11.3(+IN) IC12.6(D1) R36.2
NetC20_2: C20.2 R30.2 R31.1
NetC23_2: C23.2 R34.2 R35.1
NetD27_2: D27.2(A) D29.1 IC12.5(S1B) J13.1 R36.1 ; port PS3_VMON
NetD28_2: D28.2(A) D30.1 IC12.10(S2B) J13.2 R38.1 ; port PS3_IMON
NetD31_1: D31.1 J14.1 R29.2 ; port DISPLAY_PS3_VMON
NetD32_1: D32.1 J14.3 R33.2 ; port DISPLAY_PS3_IMON
NetIC6_1: IC12.1(A0) IC12.14(A1) ; port INTEGRITY_CHECK_DISABLE
NetIC6_4: IC12.4(S1A) ; port PS_VOLTAGE_REFERENCE
NetIC6_11: IC12.11(S2A) ; port PS_CURRENT_REFERENCE
NetIC11_2: IC11.2(-IN) IC11.6(OUT) R29.1 R30.1
NetIC13_2: IC13.2(-IN) IC13.6(OUT) R33.1 R34.1
NetIC28_2: R31.2 R32.2 ; port SCALED_PS3_VMON
NetIC28_4: R35.2 R37.2 ; port SCALED_PS3_IMON

Not connected (* = marked no-connect by the designer): IC11 1(NC)* 5(NC)* 8(NC)*; IC12 7(NC)* 8(NC)*; IC13 1(NC)* 5(NC)* 8(NC)*

### Notes on the sheet
- [PS3] - Measurement
- Assembly Note
- Os resistores de 0R deverão ser montados apenas quando o DG636EEQ-T1-GE4 estiver ausente no circuito.
- Title:
- Drawn by:
- Revision:
- Copyright CNPEM 2023.
  This documentation describes Open Hardware and is licensed under the CERN OHL S v2. You may redistribute and modify this documentation under the terms of the CERN OHL S v2. (https://www.ohwr.org/cernohl). This documentation is distributed WITHOUT ANY EXPRESS OR IMPLIED WARRANTY, INCLUDING OF MERCHANTABILITY, SATISFACTORY QUALITY AND FITNESS FOR A PARTICULAR PURPOSE. Please see the CERN OHL S v2 for applicable conditions.
- File:
- Date:
- Project:
- Time:
- Sheet
- of
- ENT - AIS - SEI
  Sistemas Eletrônicos e
  Instrumentação
- (in symbol Conector Phoenix 3 vias) Phoenix Contact
- (in symbol Phoenix 1755736) Phoenix Contact

### Library data of the parts
C19 C21 C22 = Capacitor 100nF
C20 = Capacitor 68nF
C23 = Capacitor 56nF
D27 D28 = LSM115JE3/TR13: DIODE SCHOTTKY 15V, 1A, DO214BA
D29-D32 = AQ4023-01FTG: Unidirectional TVS DIode, 12A, 1.3pF
IC11 IC13 = AD8638ARZ: as IC29 on sheet isolated-analog-interface-hw
IC12 = DG636EEQ-T1-GE4: Analog Switch Dual-SPDT, 14 pins; Supplier 1: Newark; Supplier Part Number 1: 56AJ9808
J13 = Phoenix 1755736: Term Block HDR 2POS VERT 5.08MM
J14 = Conector Phoenix 3 vias
R29 R30 R33 R34 = Resistor 330R
R31 = Resistor 650R
R32 R37 = Resistor 280R
R35 = Resistor 2k4
R36 R38 = Resistor 0R - 0805: Size 0805

## Sheet power-supplies-hw.SchDoc
size A3; SheetNumber: 9; SheetTotal: 10
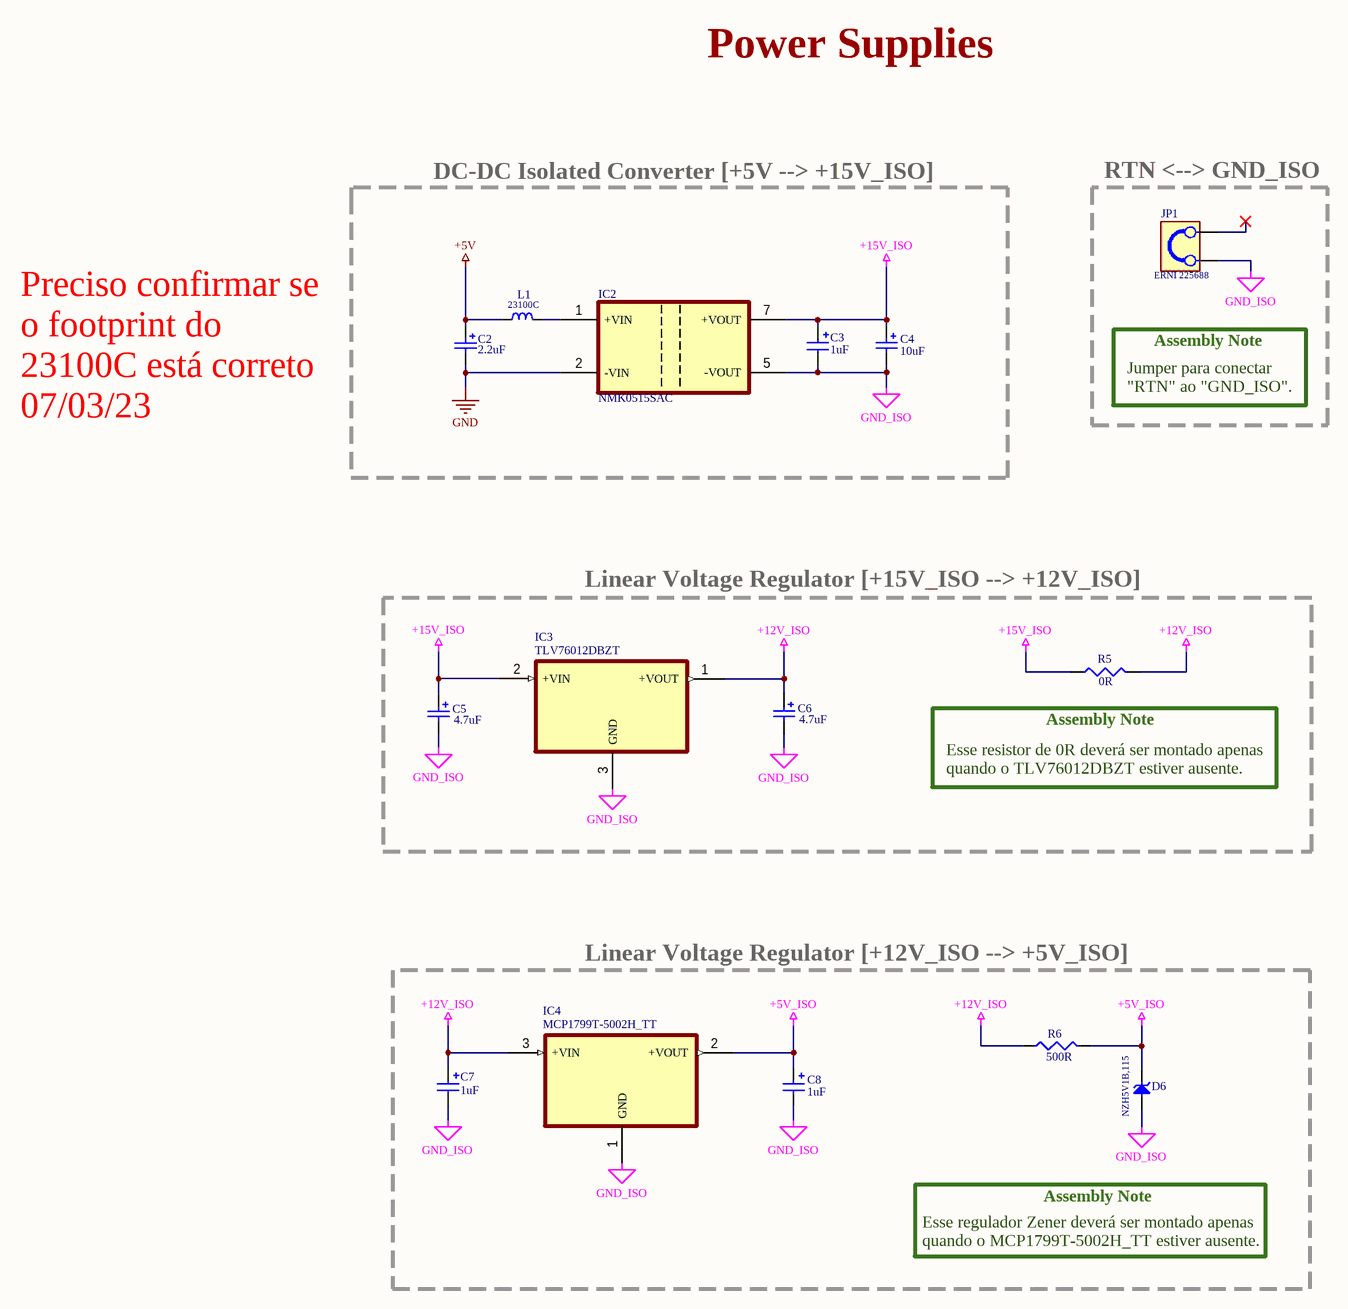
[diagram p12: power-supplies-hw.SchDoc]

### Parts
C2  2.2uF  [C1206]
C3  1uF  [C1206]
C4  10uF  [C1206]
C5  4.7uF  [C1206]
C6  4.7uF  [C1206]
C7  1uF  [C1206]
C8  1uF  [C1206]
D6  NZH5V1B,115  [SOD-123F-2]
IC2  NMK0515SAC  [NMK0515SAC]
IC3  TLV76012DBZT  [SOT_23_3]
IC4  MCP1799T-5002H_TT  [SOT_23_3]
JP1  ERNI 225688  [ERNI 225688]
L1  23100C  [23100C]
R5  0R  [R1210]
R6  500R  [Resistor 0805]

### Blocks framed on the sheet
DC-DC Isolated Converter [+5V --> +15V_ISO]: C2-C4 IC2 L1
RTN <--> GND_ISO: JP1
Linear Voltage Regulator [+15V_ISO --> +12V_ISO]: C5 C6 IC3 R5
Linear Voltage Regulator [+12V_ISO --> +5V_ISO]: C7 C8 D6 IC4 R6

### Nets
+5V: C2.1 L1.1
+5V_ISO: C8.1 D6.1 IC4.2(+VOUT) R6.2
+12V_ISO: C6.1 C7.1 IC3.1(+VOUT) IC4.3(+VIN) R5.2 R6.1
+15V_ISO: C3.1 C4.1 C5.1 IC2.7(+VOUT) IC3.2(+VIN) R5.1
GND: C2.2 IC2.2(-VIN)
GND_ISO: C3.2 C4.2 C5.2 C6.2 C7.2 C8.2 D6.2 IC2.5(-VOUT) IC3.3(GND) IC4.1(GND) JP1.1
NetIC2_1: IC2.1(+VIN) L1.2

Not connected (* = marked no-connect by the designer): JP1 2*

### Notes on the sheet
- Power Supplies
- Assembly Note
- Jumper para conectar "RTN" ao "GND_ISO".
- Preciso confirmar se o footprint do 23100C está correto 07/03/23
- (near R5) Assembly Note
- Esse resistor de 0R deverá ser montado apenas quando o TLV76012DBZT estiver ausente.
- Esse regulador Zener deverá ser montado apenas quando o MCP1799T-5002H_TT estiver ausente.
- Title:
- Date:
- Project:
- Drawn by:
- Time:
- Revision:
- Sheet
- of
- ENT - AIS - SEI
  Sistemas Eletrônicos e
  Instrumentação
- Copyright CNPEM 2023.
  This documentation describes Open Hardware and is licensed under the CERN OHL S v2. You may redistribute and modify this documentation under the terms of the CERN OHL S v2. (https://www.ohwr.org/cernohl). This documentation is distributed WITHOUT ANY EXPRESS OR IMPLIED WARRANTY, INCLUDING OF MERCHANTABILITY, SATISFACTORY QUALITY AND FITNESS FOR A PARTICULAR PURPOSE. Please see the CERN OHL S v2 for applicable conditions.
- File:

### Library data of the parts
C2 = Capacitor 2.2uF
C3 C7 C8 = Capacitor 1uF
C4 = Capacitor 10uF
C5 C6 = Capacitor 4.7uF
D6 = Zener NZH5V1B,115: 5.1V, SOD-123F-2
IC2 = NMK0515SAC: 3kVDC Isolated 2W Single Output DC-DC Converter
IC3 = TLV76012DBZT: Linear-Voltage Regulator, +12V Fixed-Output, 100mA
IC4 = MCP1799T-5002H_TT: High-Voltage Automotive LDO, 80mA
L1 = 23100C: Bobbin Wound Surface Mount Inductors, 10uH, 138mOhms, Imax 1.02A
R5 = Resistor 0R: Size 1210
R6 = Resistor 500R

## Sheet temp-sensor-interface-hw.SchDoc
size A3; Date: 03/03/2023; SheetNumber: 10; SheetTotal: 10; Group: CoP
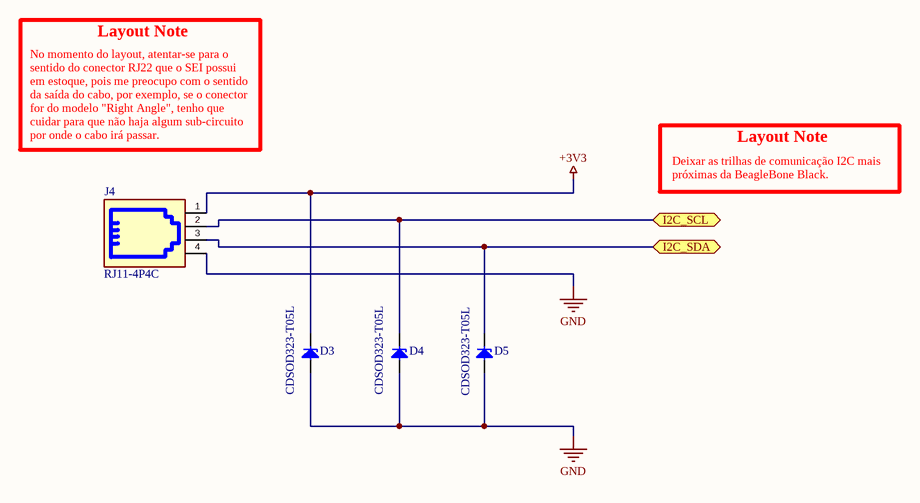
[diagram p13: temp-sensor-interface-hw.SchDoc]

### Parts
D3  CDSOD323-T05L  [SOD-323]
D4  CDSOD323-T05L  [SOD-323]
D5  CDSOD323-T05L  [SOD-323]
J4  RJ11-4P4C  [YH55-01]

### Ports
I2C_SCL (bidir, see beaglebone-interface-hw[6A]), I2C_SDA (bidir, see beaglebone-interface-hw[7A])

### Nets
+3V3: D3.1 J4.1
GND: D3.2 D4.2 D5.2 J4.4
NetD4_1: D4.1 J4.2 ; port I2C_SCL
NetD5_1: D5.1 J4.3 ; port I2C_SDA

### Notes on the sheet
- Layout Note
- No momento do layout, atentar-se para o sentido do conector RJ22 que o SEI possui em estoque, pois me preocupo com o sentido da saída do cabo, por exemplo, se o conector for do modelo "Right Angle", tenho que cuidar para que não haja algum sub-circuito por onde o cabo irá passar.
- Deixar as trilhas de comunicação I2C mais próximas da BeagleBone Black.
- Title:
- Date:
- Project:
- Drawn by:
- Time:
- Revision:
- Sheet
- of
- ENT - AIS - SEI
  Sistemas Eletrônicos e
  Instrumentação
- Copyright CNPEM 2023.
  This documentation describes Open Hardware and is licensed under the CERN OHL S v2. You may redistribute and modify this documentation under the terms of the CERN OHL S v2. (https://www.ohwr.org/cernohl). This documentation is distributed WITHOUT ANY EXPRESS OR IMPLIED WARRANTY, INCLUDING OF MERCHANTABILITY, SATISFACTORY QUALITY AND FITNESS FOR A PARTICULAR PURPOSE. Please see the CERN OHL S v2 for applicable conditions.
- File:

### Library data of the parts
D3-D5 = CDSOD323-T05L: Unidirectional TVS Diode; Supplier 1: Avnet; Supplier Part Number 1: CDSOD323-T05L
J4 = RJ11: MC114268 JACK RJ11 4P4C PARA PLACA 14.5X10X12MM, CODIGO YH55-01, DAIER

## Nets that join several sheets
+3V3: beaglebone-interface-hw (7 pins), frontpanel-hw (8 pins), temp-sensor-interface-hw (D3.1 J4.1)
+5V: beaglebone-interface-hw (5 pins), calibration-hw (C34.1 C35.1 IC23.1 IC25.1), isolated-analog-interface-hw (10 pins), power-supplies-hw (C2.1 L1.1)
+5V_ISO: isolated-analog-interface-hw (9 pins), power-supplies-hw (C8.1 D6.1 IC4.2 R6.2)
+12V_ISO: calibration-hw (6 pins), measurement-output-hw (22 pins), measurement-ps1-hw (9 pins), measurement-ps2-hw (9 pins), measurement-ps3-hw (9 pins), power-supplies-hw (6 pins)
GND: beaglebone-interface-hw (18 pins), calibration-hw (C34.2 C35.2 Q6.2 Q8.2), frontpanel-hw (12 pins), isolated-analog-interface-hw (12 pins), power-supplies-hw (C2.2 IC2.2), temp-sensor-interface-hw (D3.2 D4.2 D5.2 J4.4)
GND_ISO: calibration-hw (10 pins), isolated-analog-interface-hw (12 pins), measurement-output-hw (35 pins), measurement-ps1-hw (16 pins), measurement-ps2-hw (16 pins), measurement-ps3-hw (16 pins), power-supplies-hw (11 pins)
NetD4_1: beaglebone-interface-hw (J2.17B), temp-sensor-interface-hw (D4.1 J4.2)
NetD5_1: beaglebone-interface-hw (J2.18B), temp-sensor-interface-hw (D5.1 J4.3)
NetD8_1: beaglebone-interface-hw (IC1.2), frontpanel-hw (D8.1 J5.2 R7.2)
NetD10_1: beaglebone-interface-hw (IC1.5), frontpanel-hw (D10.1 J6.2 R8.2)
NetD43_2: beaglebone-interface-hw (J2.39B), isolated-analog-interface-hw (D43.2 R94.2)
NetIC6_1: calibration-hw (IC23.4 R69.1), measurement-output-hw (IC17.1 IC17.14 IC20.1 IC20.14), measurement-ps1-hw (IC6.1 IC6.14), measurement-ps2-hw (IC9.1 IC9.14), measurement-ps3-hw (IC12.1 IC12.14)
NetIC6_4: calibration-hw (R77.1 R79.2), measurement-ps1-hw (IC6.4), measurement-ps2-hw (IC9.4), measurement-ps3-hw (IC12.4)
NetIC6_11: calibration-hw (R82.1 R85.2), measurement-ps1-hw (IC6.11), measurement-ps2-hw (IC9.11), measurement-ps3-hw (IC12.11)
NetIC17_4: calibration-hw (R65.1 R67.2), measurement-output-hw (IC17.4)
NetIC20_4: calibration-hw (R71.1 R74.2), measurement-output-hw (IC20.4)
NetIC28_1: isolated-analog-interface-hw (IC28.1), measurement-ps2-hw (R21.2 R22.2)
NetIC28_2: isolated-analog-interface-hw (IC28.2), measurement-ps3-hw (R31.2 R32.2)
NetIC28_4: isolated-analog-interface-hw (IC28.4), measurement-ps3-hw (R35.2 R37.2)
NetIC28_5: isolated-analog-interface-hw (IC28.5), measurement-ps2-hw (R25.2 R27.2)
NetIC28_12: isolated-analog-interface-hw (IC28.12), measurement-ps1-hw (R15.2 R17.2)
NetIC28_13: isolated-analog-interface-hw (IC28.13), measurement-output-hw (R44.1 R46.2)
NetIC28_14: isolated-analog-interface-hw (IC28.14), measurement-output-hw (R58.1 R62.2)
NetIC28_15: isolated-analog-interface-hw (IC28.15), measurement-ps1-hw (R11.2 R12.2)
NetJ2_11A: beaglebone-interface-hw (J2.11A), frontpanel-hw (Q2.1)
NetJ2_12A: beaglebone-interface-hw (J2.12A), frontpanel-hw (Q3.1)
NetJ2_23B: beaglebone-interface-hw (J2.23B), isolated-analog-interface-hw (Q10.1)
NetJ2_25B: beaglebone-interface-hw (J2.25B), isolated-analog-interface-hw (Q11.1)
NetJ2_27B: beaglebone-interface-hw (J2.27B), isolated-analog-interface-hw (Q12.1)
NetJ2_43A: beaglebone-interface-hw (J2.43A), calibration-hw (Q6.1)
NetJ2_44A: beaglebone-interface-hw (J2.44A), calibration-hw (Q8.1)